# EAGLE board CounterModule (EAGLE 7.7.0), part 1 of 2
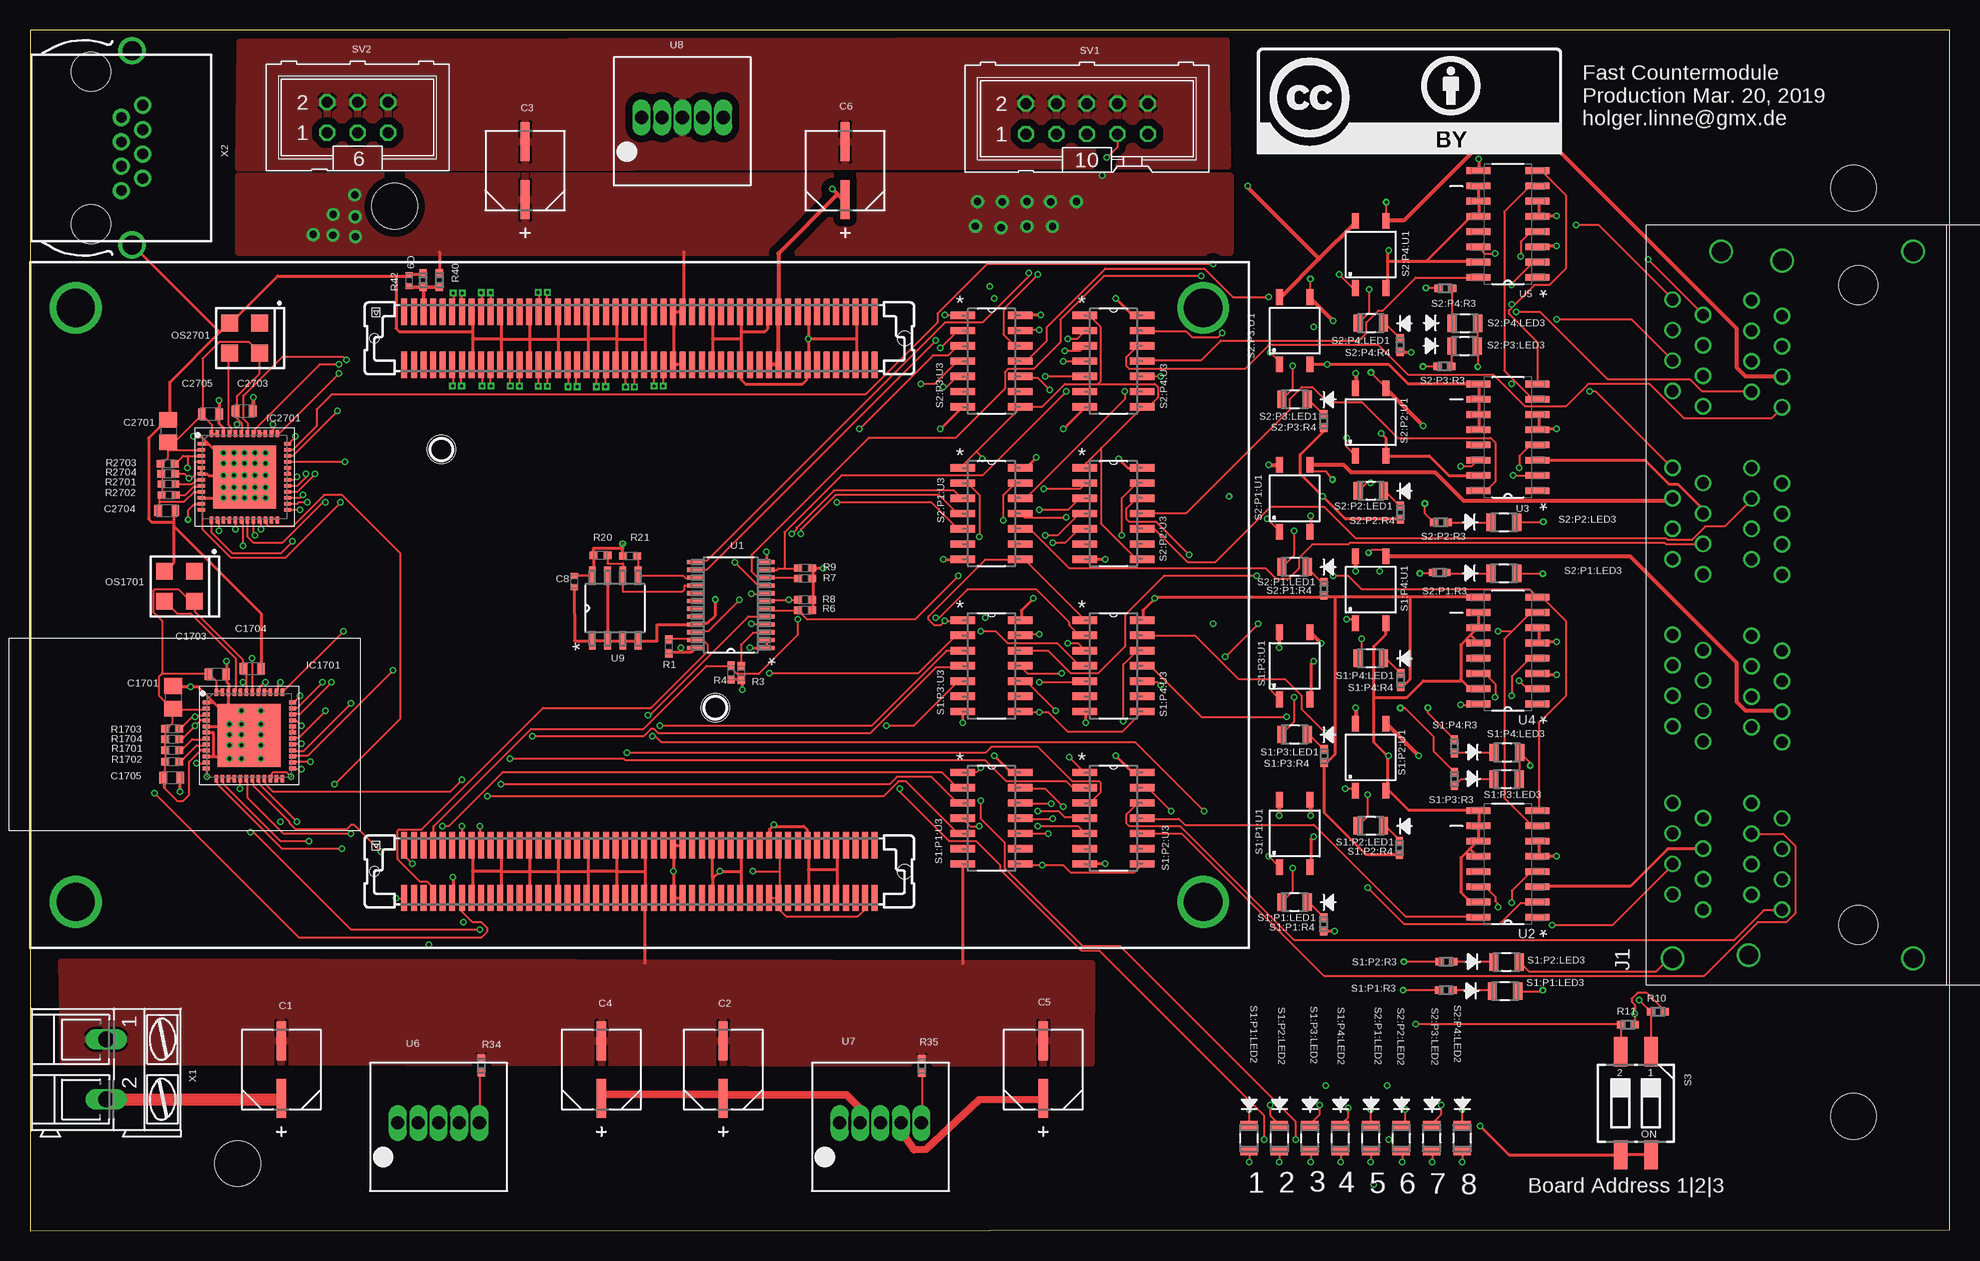
[diagram p8: board, top side]
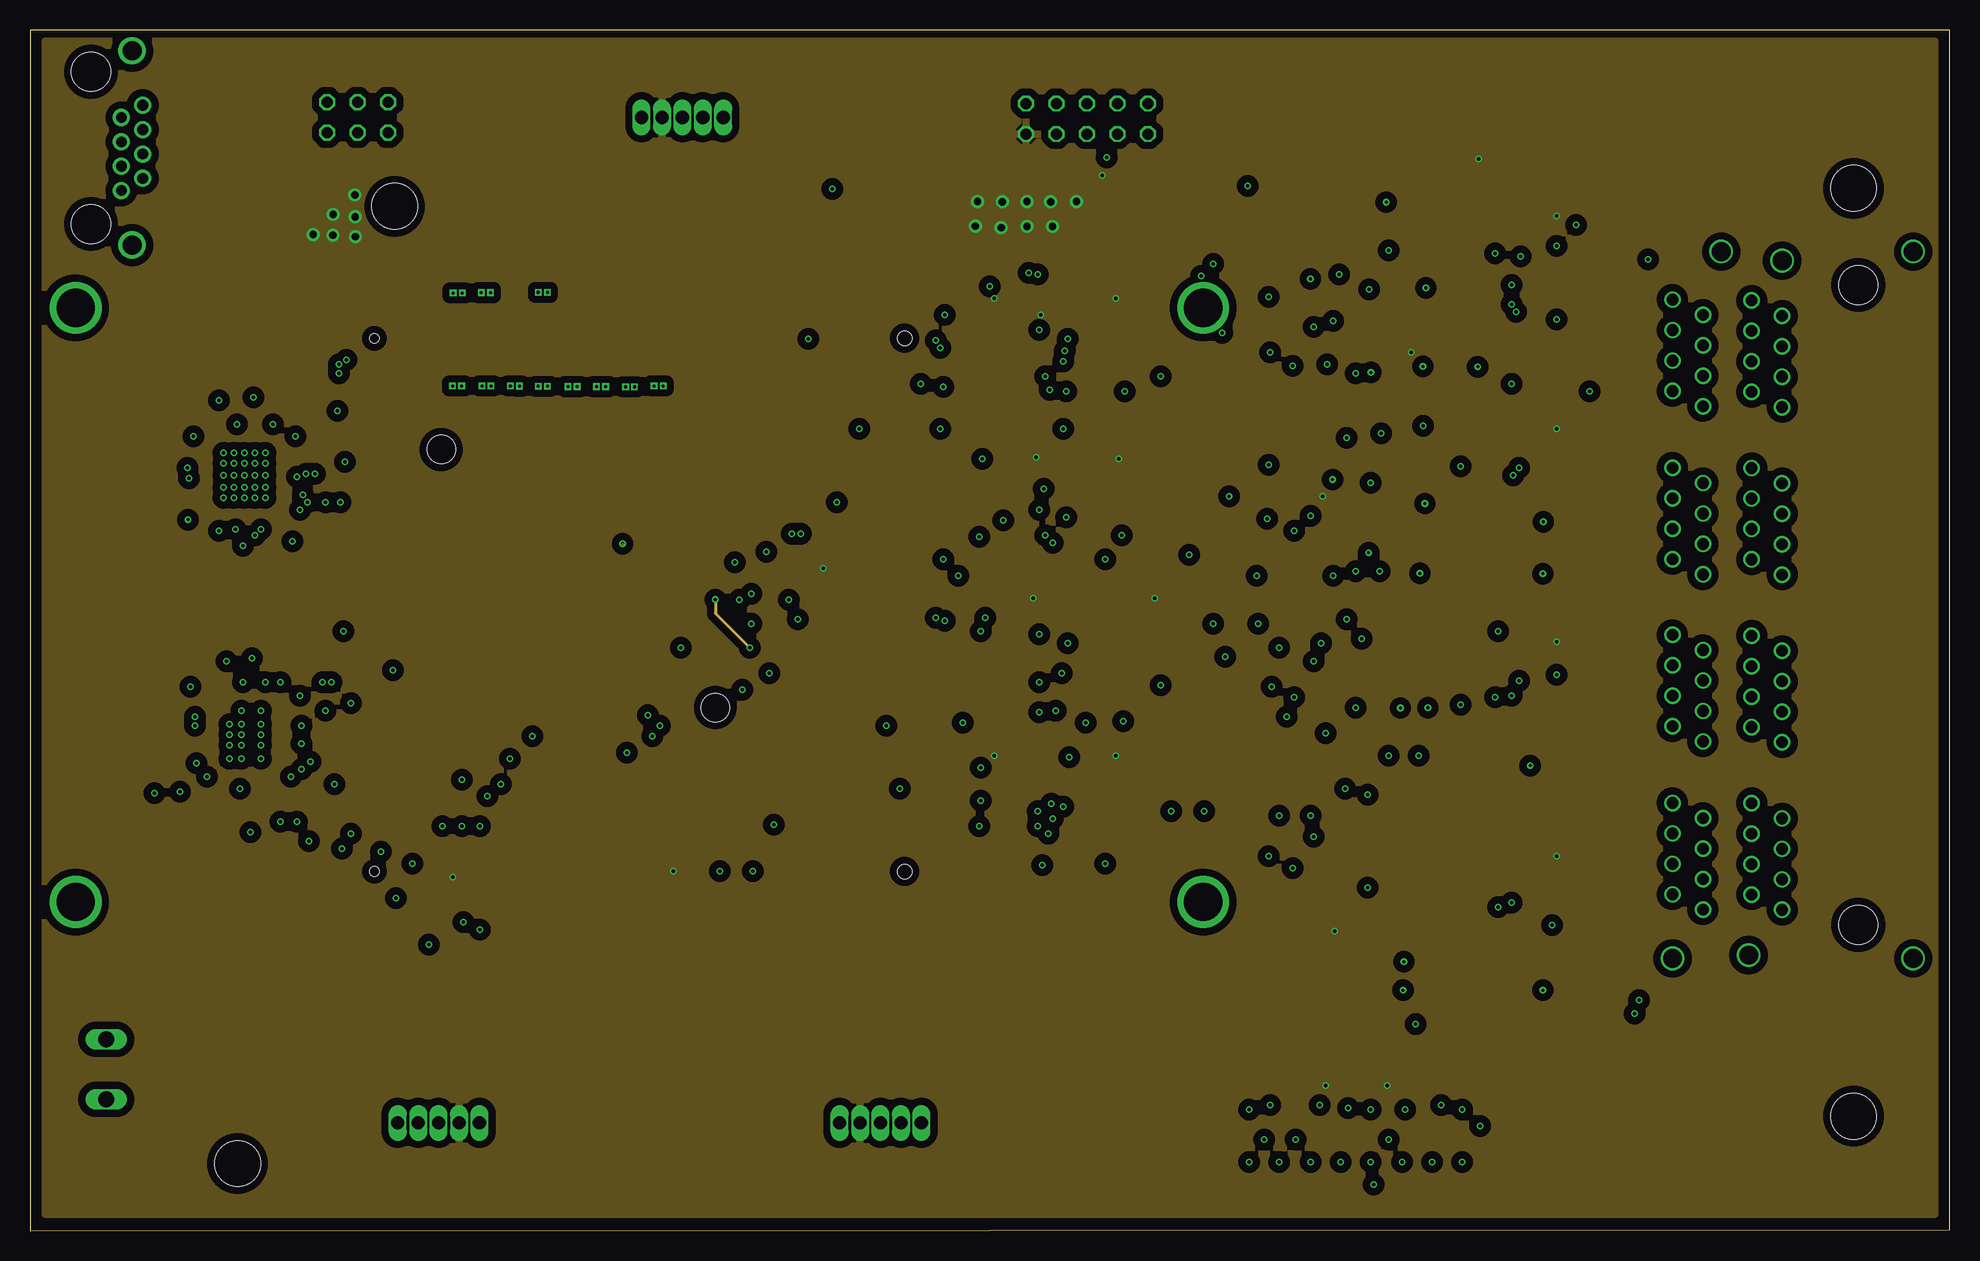
[diagram p9: board, inner layer +5V]
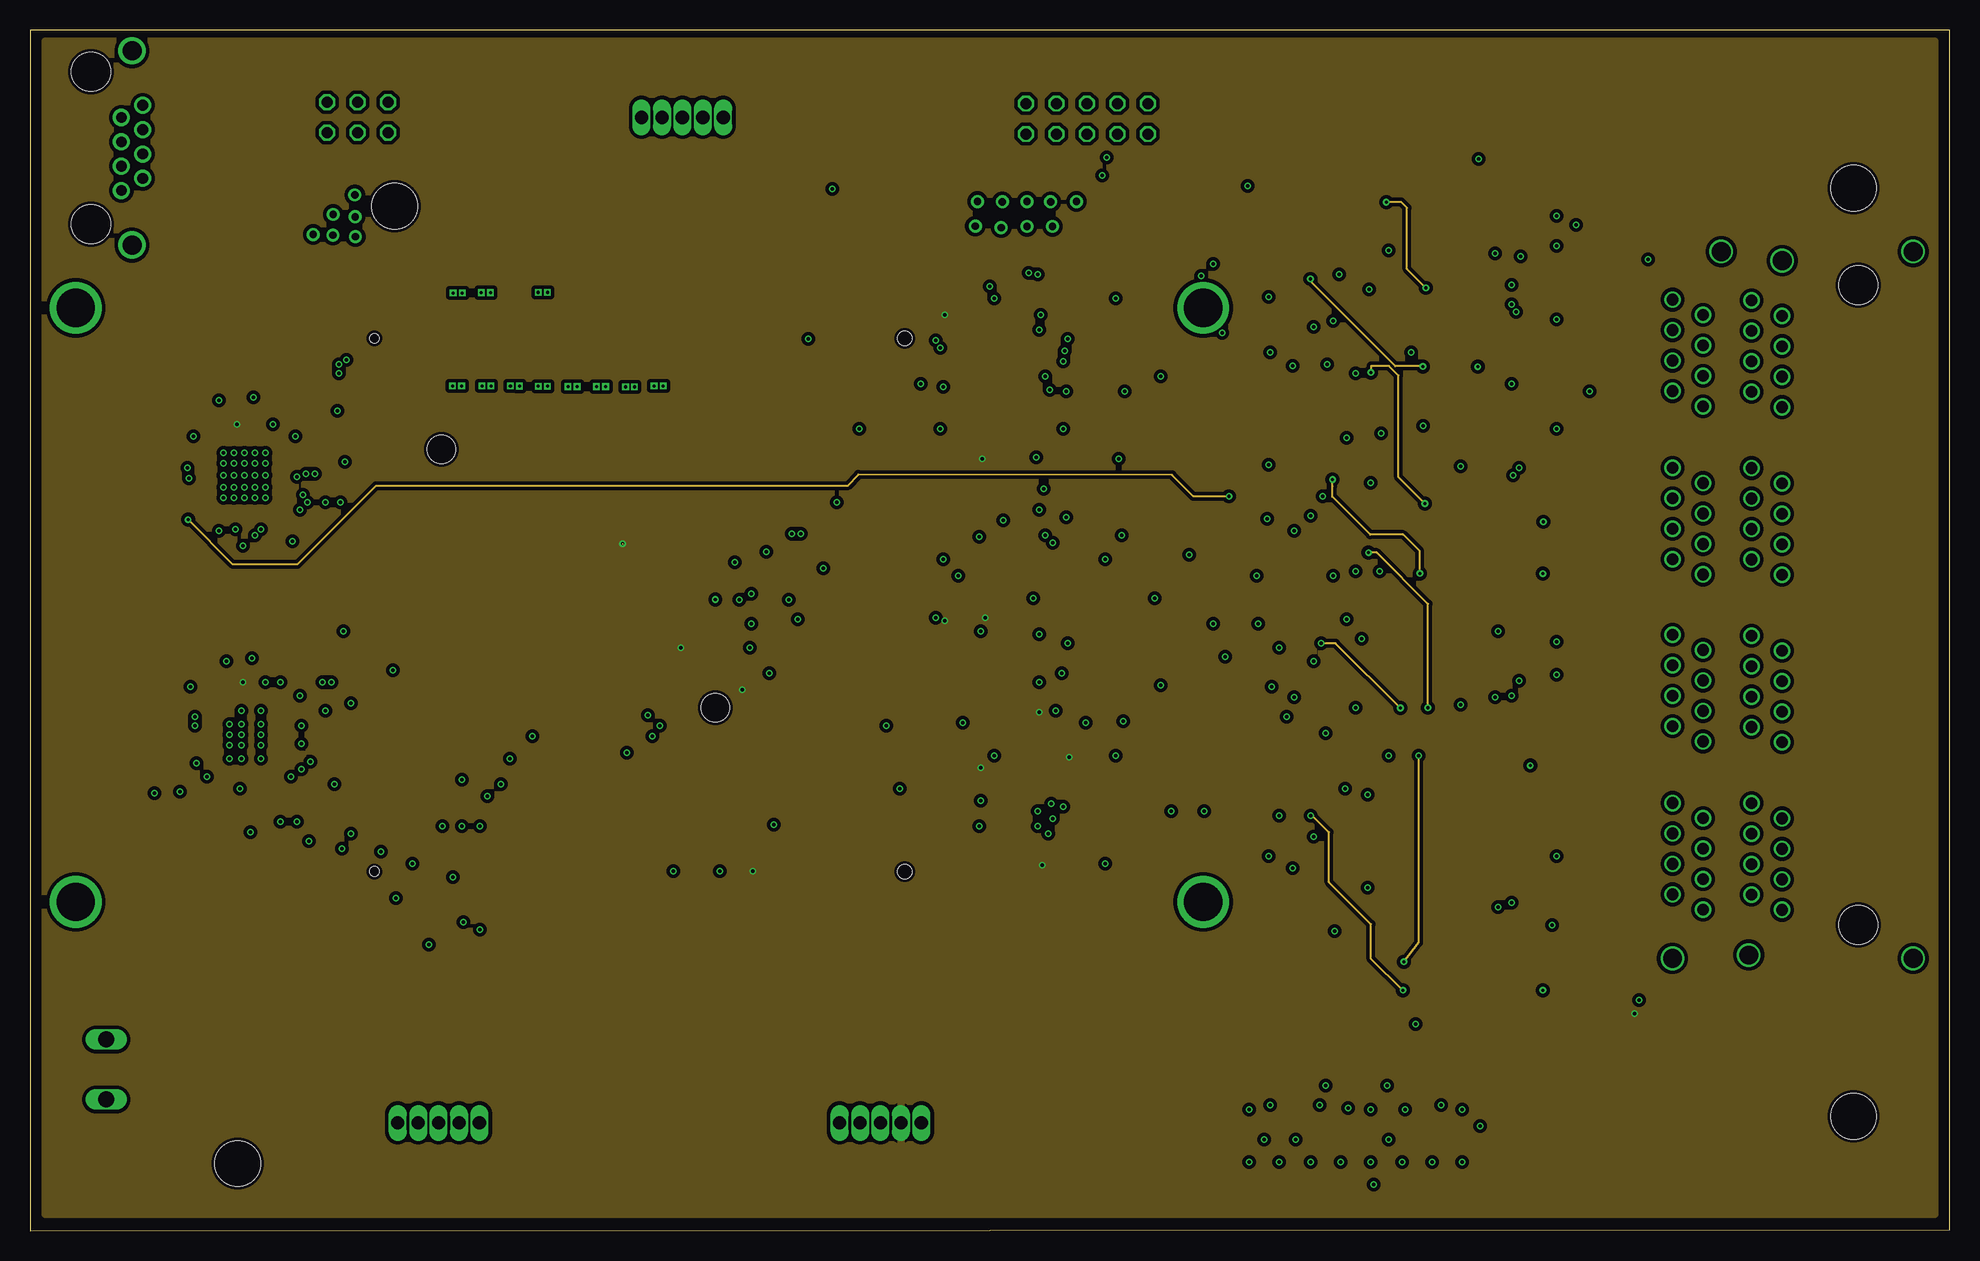
[diagram p10: board, inner layer +3V3]
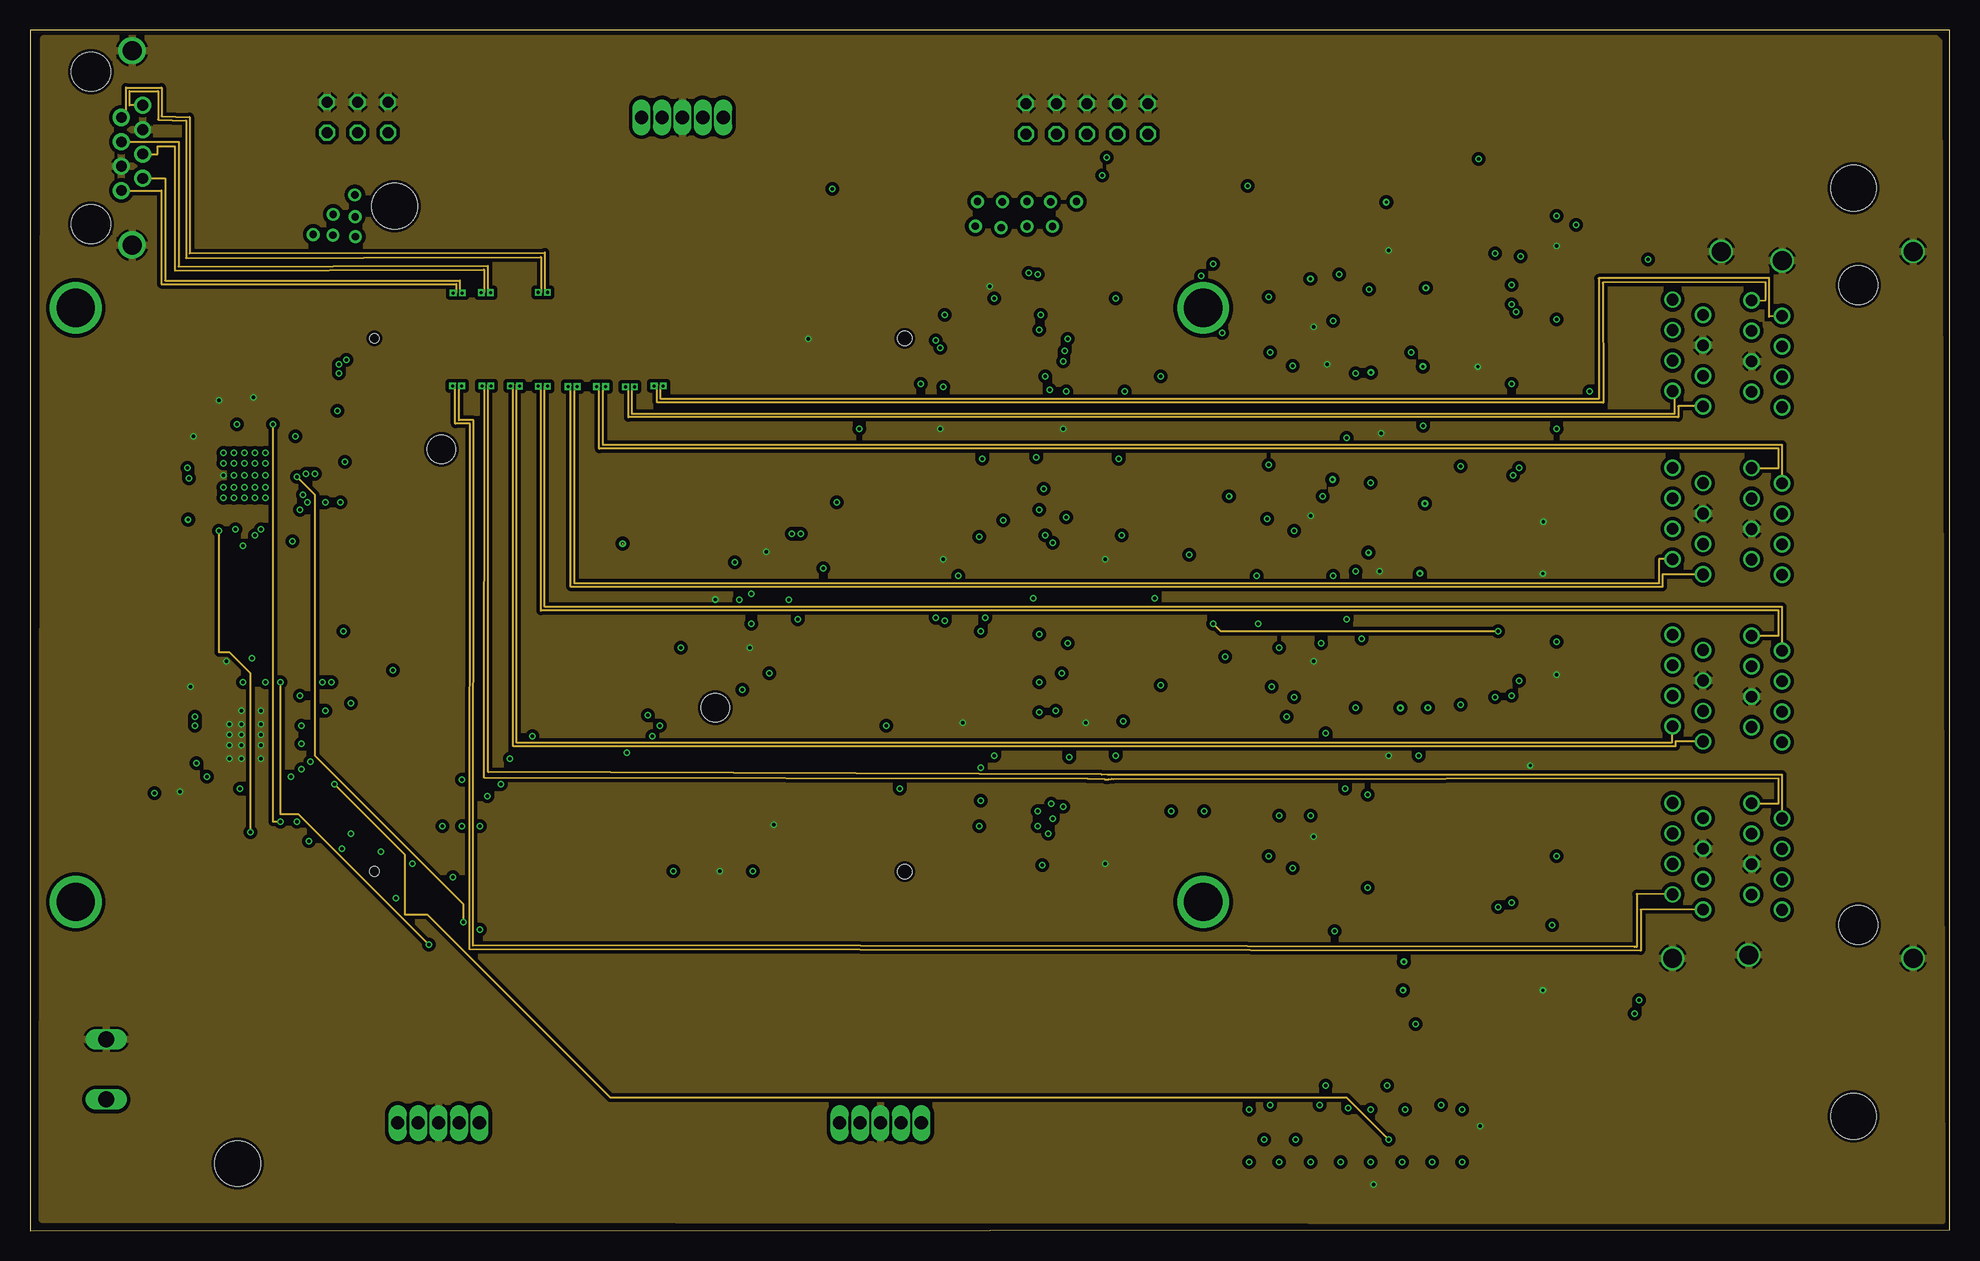
[diagram p11: board, inner layer Difflines]
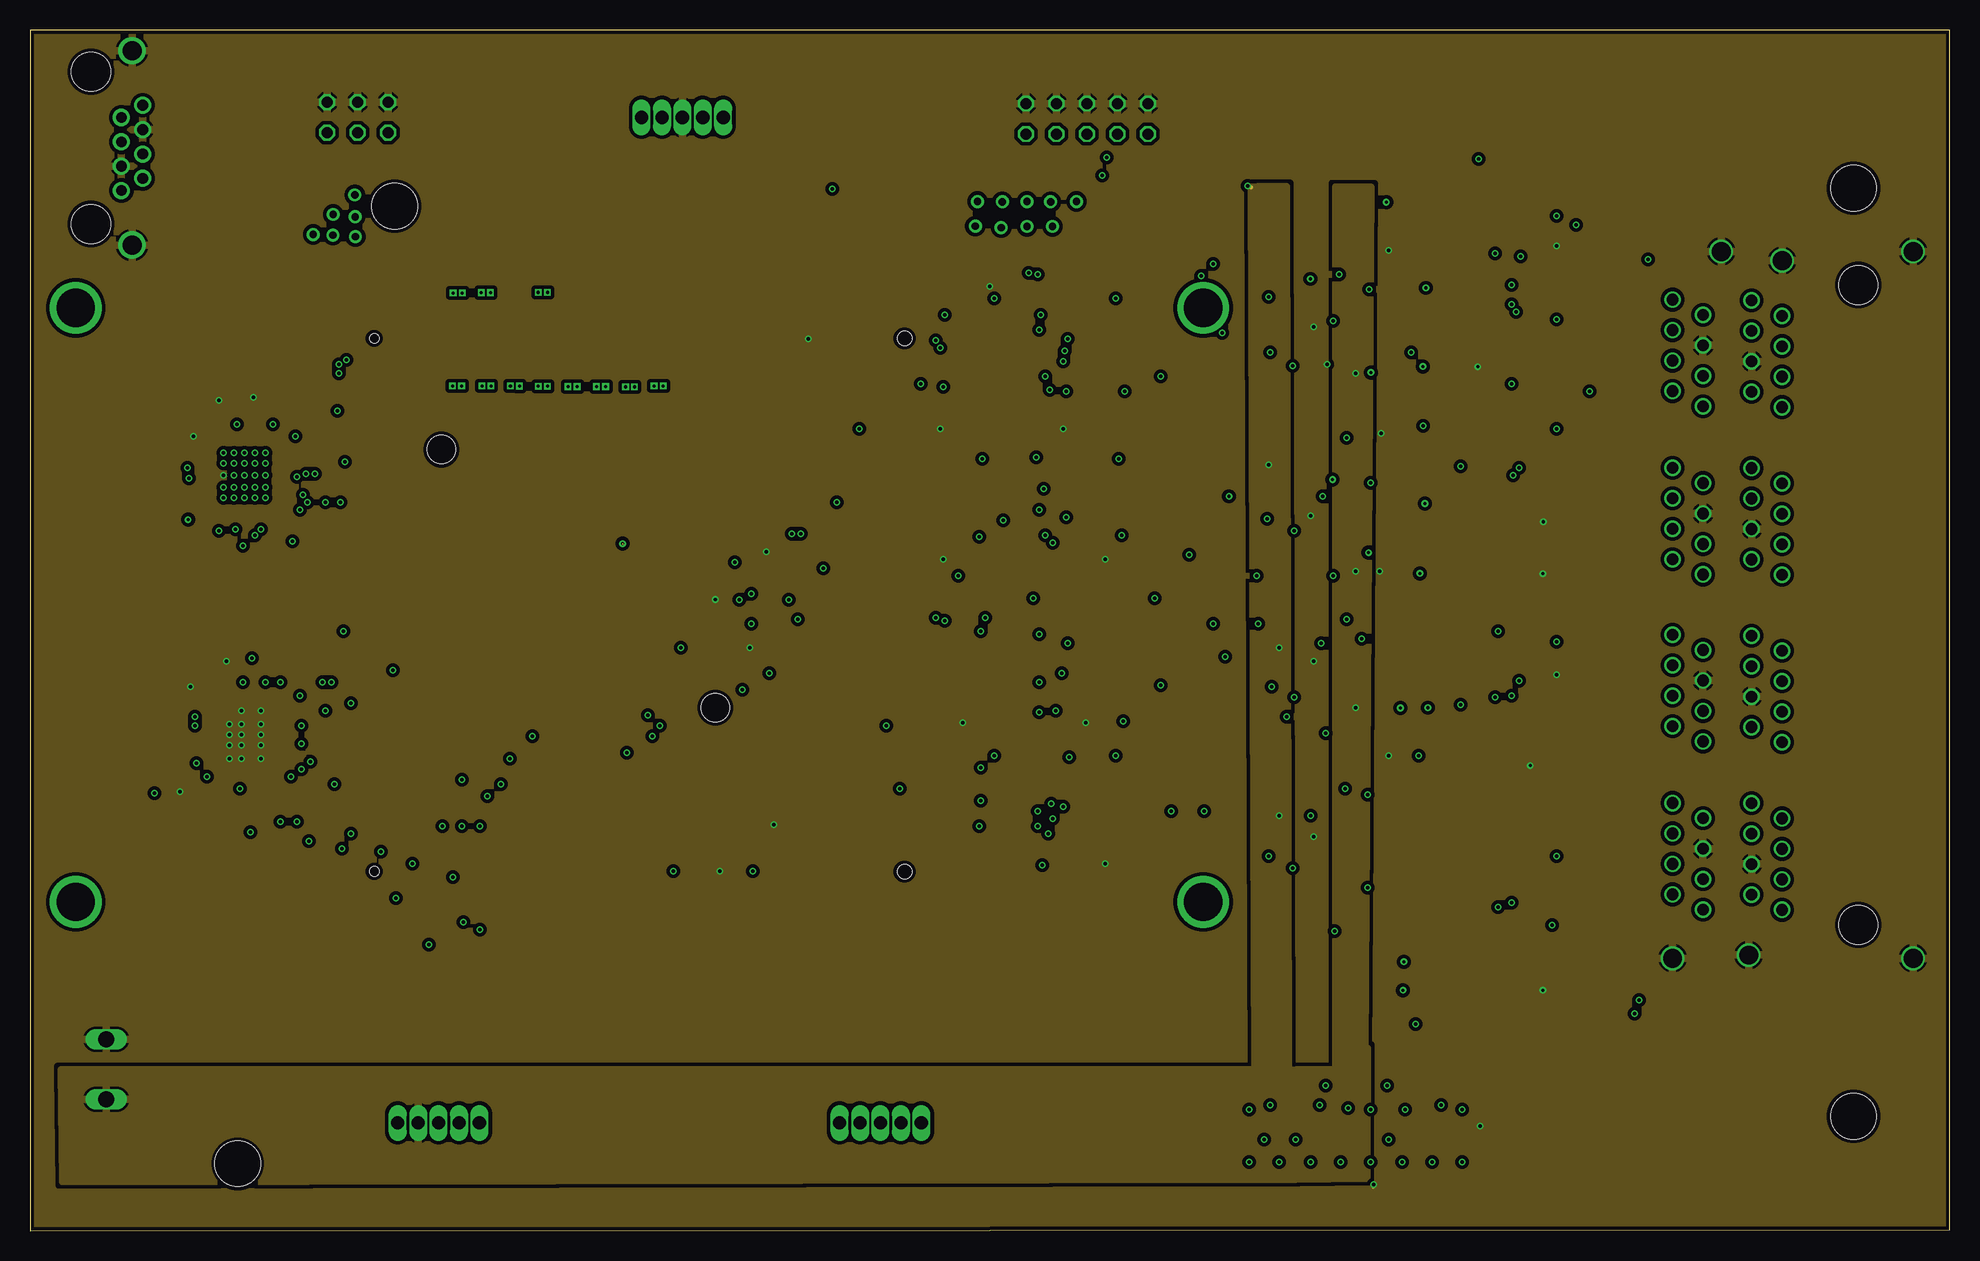
[diagram p12: board, inner layer GND+12V]
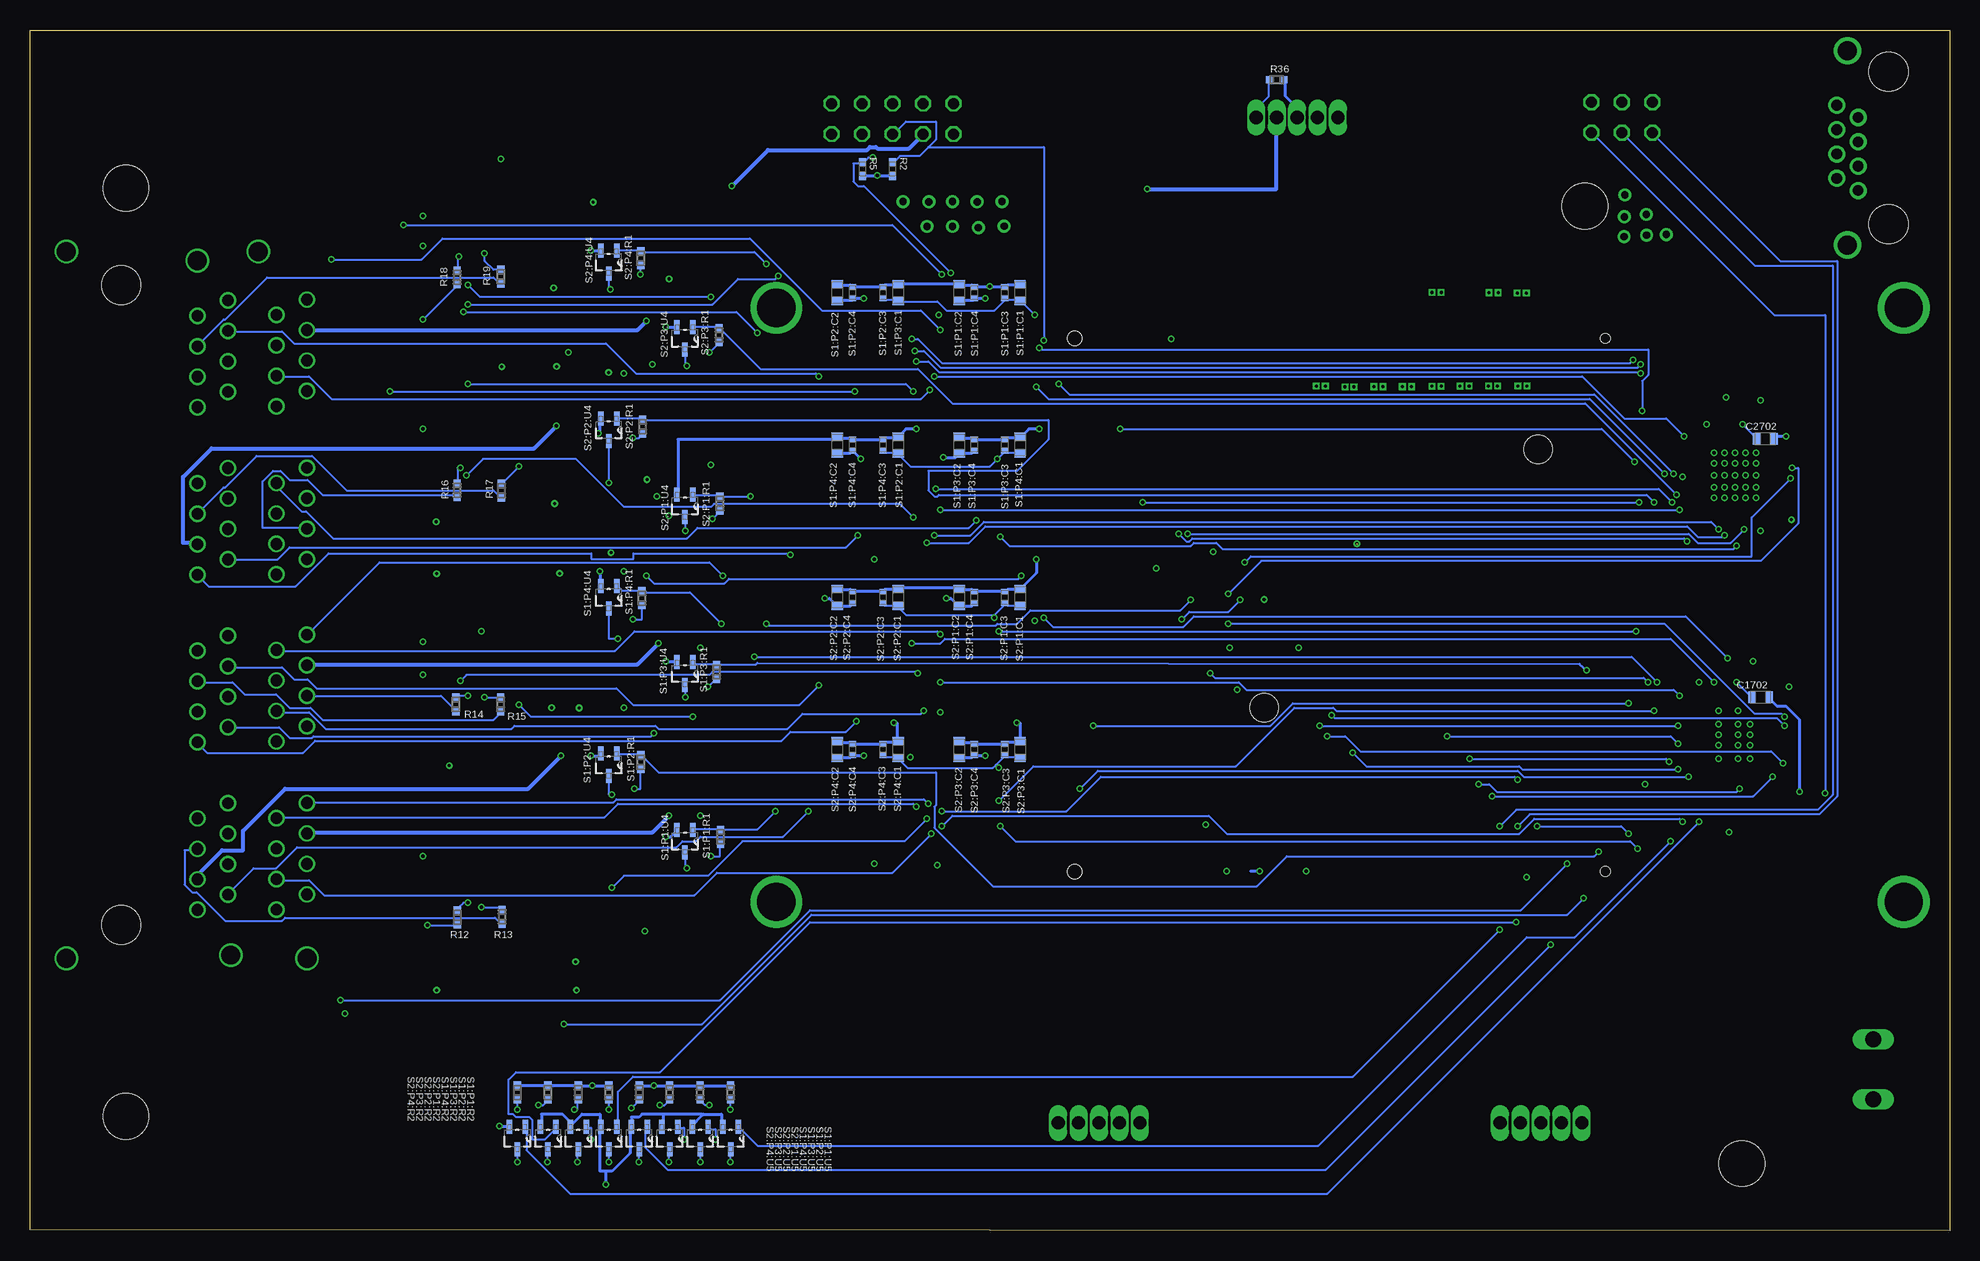
[diagram p13: board, bottom side, seen from below]

Size 160 x 100.11 mm. Coordinates in mm from the lower left corner, seen from the top.
Outline: 0,100.11 0,0 160,0.11 160,100.11 0,100.11
Copper layers (1+2+3*14+15+16): Top 0.035mm / dielectric 0.2mm / +5V 0.035mm / dielectric 0.36mm / +3V3 0.035mm / dielectric 0.28mm / Difflines 0.035mm / dielectric 0.36mm / GND+12V 0.035mm / dielectric 0.2mm / Bottom 0.035mm
Design rules "PCB-POOL HighSpec_ML6 *": minimum track width 0.15mm, minimum drill 0.2mm, track to track 0.15mm, track to pad 0.15mm, pad to pad 0.15mm, via to via 0.15mm, smd to smd 0.14mm, copper to edge 0.15mm, drill to drill 0.15mm, minimum pad ring 0.2mm, minimum via ring 0.15mm, stop-mask expansion 0.075mm, vias tented up to drill 0mil, thermal gap 0.2mm
Net classes: 0 default: width 0.15 mm, drill 0.254 mm, clearance 0.15 mm; 1 power: width 0.25 mm, drill 0.254 mm, clearance 0.305 mm to class 0, clearance 0.305 mm; 2 xpower: width 0.35 mm, drill 0.254 mm, clearance 0.305 mm to class 0, clearance 0.305 mm to class 1, clearance 0.305 mm
Holes 3.81 mm at 152,86.91 152,9.56 17.3,5.61 30.4,85.41

## Footprints (pad centres in the part's own frame; a part is rotated, then mirrored left to right if it is on the bottom)
CAPAE660X800N = smd 3.251 x 0.762: 1 -2.413,0; 2 2.413,0
CAPC1005X60N = smd 0.457 x 0.61: 1 -0.483,0; 2 0.483,0
C0805 = smd 1.3 x 1.5: 1 -0.95,0; 2 0.95,0
CAPC1608X90N = smd 0.66 x 0.94: 1 -0.711,0; 2 0.711,0
QFN50P700X700X80-49N = smd 0.6 x 0.3: 1 -3.6,2.75; 2 -3.6,2.25; 3 -3.6,1.75; 4 -3.6,1.25; 5 -3.6,0.75; 6 -3.6,0.25; 7 -3.6,-0.25; 8 -3.6,-0.75; 9 -3.6,-1.25; 10 -3.6,-1.75; 11 -3.6,-2.25; 12 -3.6,-2.75; 25 3.6,-2.75; 26 3.6,-2.25; 27 3.6,-1.75; 28 3.6,-1.25; 29 3.6,-0.75; 30 3.6,-0.25; 31 3.6,0.25; 32 3.6,0.75; 33 3.6,1.25; 34 3.6,1.75; 35 3.6,2.25; 36 3.6,2.75 | smd 0.3 x 0.6: 13 -2.75,-3.6; 14 -2.25,-3.6; 15 -1.75,-3.6; 16 -1.25,-3.6; 17 -0.75,-3.6; 18 -0.25,-3.6; 19 0.25,-3.6; 20 0.75,-3.6; 21 1.25,-3.6; 22 1.75,-3.6; 23 2.25,-3.6; 24 2.75,-3.6; 37 2.75,3.6; 38 2.25,3.6; 39 1.75,3.6; 40 1.25,3.6; 41 0.75,3.6; 42 0.25,3.6; 43 -0.25,3.6; 44 -0.75,3.6; 45 -1.25,3.6; 46 -1.75,3.6; 47 -2.25,3.6; 48 -2.75,3.6 | smd 5.25 x 5.25: 49 0,0
AMP2X4 = drill 1.57: GND@1 -2.79,-4.57; GND@2 56.13,-4.57; GND@3 -2.52,9.14; GND@4 55.37,6.35; GND@5 -2.79,15.49; GND@6 56.13,11.43 | drill 0.97: P1-1 10.16,15.49; P1-2 8.89,12.95; P1-3 7.62,15.49; P1-4 6.35,12.95; P1-5 5.08,15.49; P1-6 3.81,12.95; P1-7 2.54,15.49; P1-8 1.27,12.95; P2-1 1.25,6.35; P2-2 2.52,8.89; P2-3 3.79,6.35; P2-4 5.06,8.89; P2-5 6.33,6.35; P2-6 7.6,8.89; P2-7 8.87,6.35; P2-8 10.14,8.89; P3-1 24.18,15.49; P3-2 22.91,12.95; P3-3 21.64,15.49; P3-4 20.37,12.95; P3-5 19.1,15.49; P3-6 17.83,12.95; P3-7 16.56,15.49; P3-8 15.29,12.95; P4-1 15.22,6.35; P4-2 16.49,8.89; P4-3 17.76,6.35; P4-4 19.03,8.89; P4-5 20.3,6.35; P4-6 21.57,8.89; P4-7 22.84,6.35; P4-8 24.11,8.89; P5-1 38.1,15.49; P5-2 36.83,12.95; P5-3 35.56,15.49; P5-4 34.29,12.95; P5-5 33.02,15.49; P5-6 31.75,12.95; P5-7 30.48,15.49; P5-8 29.21,12.95; P6-1 29.19,6.35; P6-2 30.46,8.89; P6-3 31.73,6.35; P6-4 33,8.89; P6-5 34.27,6.35; P6-6 35.54,8.89; P6-7 36.81,6.35; P6-8 38.08,8.89; P7-1 52.12,15.49; P7-2 50.85,12.95; P7-3 49.58,15.49; P7-4 48.31,12.95; P7-5 47.04,15.49; P7-6 45.77,12.95; P7-7 44.5,15.49; P7-8 43.23,12.95; P8-1 43.16,6.35; P8-2 44.43,8.89; P8-3 45.7,6.35; P8-4 46.97,8.89; P8-5 48.24,6.35; P8-6 49.51,8.89; P8-7 50.78,6.35; P8-8 52.05,8.89 | hole 3.251: 0,0; 53.34,0
MICROZED_REV_F = smd 0.5 x 2.2: JX1_1 19.6,-24.425; JX1_2 19.6,-20.025; JX1_3 18.8,-24.425; JX1_4 18.8,-20.025; JX1_5 18,-24.425; JX1_6 18,-20.025; JX1_7 17.2,-24.425; JX1_8 17.2,-20.025; JX1_9 16.4,-24.425; JX1_10 16.4,-20.025; JX1_11 15.6,-24.425; JX1_12 15.6,-20.025; JX1_13 14.8,-24.425; JX1_14 14.8,-20.025; JX1_15 14,-24.425; JX1_16 14,-20.025; JX1_17 13.2,-24.425; JX1_18 13.2,-20.025; JX1_19 12.4,-24.425; JX1_20 12.4,-20.025; JX1_21 11.6,-24.425; JX1_22 11.6,-20.025; JX1_23 10.8,-24.425; JX1_24 10.8,-20.025; JX1_25 10,-24.425; JX1_26 10,-20.025; JX1_27 9.2,-24.425; JX1_28 9.2,-20.025; JX1_29 8.4,-24.425; JX1_30 8.4,-20.025; JX1_31 7.6,-24.425; JX1_32 7.6,-20.025; JX1_33 6.8,-24.425; JX1_34 6.8,-20.025; JX1_35 6,-24.425; JX1_36 6,-20.025; JX1_37 5.2,-24.425; JX1_38 5.2,-20.025; JX1_39 4.4,-24.425; JX1_40 4.4,-20.025; JX1_41 3.6,-24.425; JX1_42 3.6,-20.025; JX1_43 2.8,-24.425; JX1_44 2.8,-20.025; JX1_45 2,-24.425; JX1_46 2,-20.025; JX1_47 1.2,-24.425; JX1_48 1.2,-20.025; JX1_49 0.4,-24.425; JX1_50 0.4,-20.025; JX1_51 -0.4,-24.425; JX1_52 -0.4,-20.025; JX1_53 -1.2,-24.425; JX1_54 -1.2,-20.025; JX1_55 -2,-24.425; JX1_56 -2,-20.025; JX1_57 -2.8,-24.425; JX1_58 -2.8,-20.025; JX1_59 -3.6,-24.425; JX1_60 -3.6,-20.025; JX1_61 -4.4,-24.425; JX1_62 -4.4,-20.025; JX1_63 -5.2,-24.425; JX1_64 -5.2,-20.025; JX1_65 -6,-24.425; JX1_66 -6,-20.025; JX1_67 -6.8,-24.425; JX1_68 -6.8,-20.025; JX1_69 -7.6,-24.425; JX1_70 -7.6,-20.025; JX1_71 -8.4,-24.425; JX1_72 -8.4,-20.025; JX1_73 -9.2,-24.425; JX1_74 -9.2,-20.025; JX1_75 -10,-24.425; JX1_76 -10,-20.025; JX1_77 -10.8,-24.425; JX1_78 -10.8,-20.025; JX1_79 -11.6,-24.425; JX1_80 -11.6,-20.025; JX1_81 -12.4,-24.425; JX1_82 -12.4,-20.025; JX1_83 -13.2,-24.425; JX1_84 -13.2,-20.025; JX1_85 -14,-24.425; JX1_86 -14,-20.025; JX1_87 -14.8,-24.425; JX1_88 -14.8,-20.025; JX1_89 -15.6,-24.425; JX1_90 -15.6,-20.025; JX1_91 -16.4,-24.425; JX1_92 -16.4,-20.025; JX1_93 -17.2,-24.425; JX1_94 -17.2,-20.025; JX1_95 -18,-24.425; JX1_96 -18,-20.025; JX1_97 -18.8,-24.425; JX1_98 -18.8,-20.025; JX1_99 -19.6,-24.425; JX1_100 -19.6,-20.025; JX2_1 19.6,20.025; JX2_2 19.6,24.425; JX2_3 18.8,20.025; JX2_4 18.8,24.425; JX2_5 18,20.025; JX2_6 18,24.425; JX2_7 17.2,20.025; JX2_8 17.2,24.425; JX2_9 16.4,20.025; JX2_10 16.4,24.425; JX2_11 15.6,20.025; JX2_12 15.6,24.425; JX2_13 14.8,20.025; JX2_14 14.8,24.425; JX2_15 14,20.025; JX2_16 14,24.425; JX2_17 13.2,20.025; JX2_18 13.2,24.425; JX2_19 12.4,20.025; JX2_20 12.4,24.425; JX2_21 11.6,20.025; JX2_22 11.6,24.425; JX2_23 10.8,20.025; JX2_24 10.8,24.425; JX2_25 10,20.025; JX2_26 10,24.425; JX2_27 9.2,20.025; JX2_28 9.2,24.425; JX2_29 8.4,20.025; JX2_30 8.4,24.425; JX2_31 7.6,20.025; JX2_32 7.6,24.425; JX2_33 6.8,20.025; JX2_34 6.8,24.425; JX2_35 6,20.025; JX2_36 6,24.425; JX2_37 5.2,20.025; JX2_38 5.2,24.425; JX2_39 4.4,20.025; JX2_40 4.4,24.425; JX2_41 3.6,20.025; JX2_42 3.6,24.425; JX2_43 2.8,20.025; JX2_44 2.8,24.425; JX2_45 2,20.025; JX2_46 2,24.425; JX2_47 1.2,20.025; JX2_48 1.2,24.425; JX2_49 0.4,20.025; JX2_50 0.4,24.425; JX2_51 -0.4,20.025; JX2_52 -0.4,24.425; JX2_53 -1.2,20.025; JX2_54 -1.2,24.425; JX2_55 -2,20.025; JX2_56 -2,24.425; JX2_57 -2.8,20.025; JX2_58 -2.8,24.425; JX2_59 -3.6,20.025; JX2_60 -3.6,24.425; JX2_61 -4.4,20.025; JX2_62 -4.4,24.425; JX2_63 -5.2,20.025; JX2_64 -5.2,24.425; JX2_65 -6,20.025; JX2_66 -6,24.425; JX2_67 -6.8,20.025; JX2_68 -6.8,24.425; JX2_69 -7.6,20.025; JX2_70 -7.6,24.425; JX2_71 -8.4,20.025; JX2_72 -8.4,24.425; JX2_73 -9.2,20.025; JX2_74 -9.2,24.425; JX2_75 -10,20.025; JX2_76 -10,24.425; JX2_77 -10.8,20.025; JX2_78 -10.8,24.425; JX2_79 -11.6,20.025; JX2_80 -11.6,24.425; JX2_81 -12.4,20.025; JX2_82 -12.4,24.425; JX2_83 -13.2,20.025; JX2_84 -13.2,24.425; JX2_85 -14,20.025; JX2_86 -14,24.425; JX2_87 -14.8,20.025; JX2_88 -14.8,24.425; JX2_89 -15.6,20.025; JX2_90 -15.6,24.425; JX2_91 -16.4,20.025; JX2_92 -16.4,24.425; JX2_93 -17.2,20.025; JX2_94 -17.2,24.425; JX2_95 -18,20.025; JX2_96 -18,24.425; JX2_97 -18.8,20.025; JX2_98 -18.8,24.425; JX2_99 -19.6,20.025; JX2_100 -19.6,24.425 | drill 3.175 pad 4.318: P$1 -46.99,24.765; P$2 -46.99,-24.765; P$3 46.99,24.765; P$4 46.99,-24.765 | hole 2.362: -6.325,8.56; 16.51,-12.954 | hole 0.8: 22.1,22.225; 22.1,-22.225 | hole 1.2: -22.1,22.225; -22.1,-22.225
5.0X3.2-4-PAD = smd 1.4 x 1.4: 1 -1.25,-1.25; 2 1.25,-1.25; 3 1.25,1.25; 4 -1.25,1.25
RESC1005X40N = smd 0.66 x 0.61: 1 -0.584,0; 2 0.584,0
LED_CMD17-21VGC_TR8 = smd 0.762 x 1.448: 1 -1.067,0; 2 1.067,0
LED_CMD17-21VRC_TR8 = smd 0.762 x 1.448: 1 -1.067,0; 2 1.067,0
LED_CMD17-21VYC_TR8 = smd 0.762 x 1.448: 1 -1.067,0; 2 1.067,0
4-SOP = smd 0.6 x 1.3: 1 0,-2.8; 2 2.54,-2.8; 3 2.54,2.8; 4 0,2.8
SOIC127P600X175-14N = smd 2.057 x 0.61: 1 -4.801,7.62; 2 -4.801,6.35; 3 -4.801,5.08; 4 -4.801,3.81; 5 -4.801,2.54; 6 -4.801,1.27; 7 -4.801,0; 8 0,0; 9 0,1.27; 10 0,2.54; 11 0,3.81; 12 0,5.08; 13 0,6.35; 14 0,7.62
SOT65P210X110-3N = smd 1.168 x 0.457: 1 -0.94,0.66; 2 -0.94,-0.66; 3 0.94,0
CTS-219-02 = smd 1.13 x 2.44: 1 -1.27,-4.3; 2 1.27,-4.3; 3 1.27,4.3; 4 -1.27,4.3
ML10 = drill 0.914 octagon: 1 -5.08,-1.27; 2 -5.08,1.27; 3 -2.54,-1.27; 4 -2.54,1.27; 5 0,-1.27; 6 0,1.27; 7 2.54,-1.27; 8 2.54,1.27; 9 5.08,-1.27; 10 5.08,1.27
ML6 = drill 0.914 octagon: 1 -2.54,-1.27; 2 -2.54,1.27; 3 0,-1.27; 4 0,1.27; 5 2.54,-1.27; 6 2.54,1.27
SOP65P640X110-24N = smd 1.473 x 0.356: 1 -2.921,3.581; 2 -2.921,2.921; 3 -2.921,2.286; 4 -2.921,1.626; 5 -2.921,0.965; 6 -2.921,0.33; 7 -2.921,-0.33; 8 -2.921,-0.965; 9 -2.921,-1.626; 10 -2.921,-2.286; 11 -2.921,-2.921; 12 -2.921,-3.581; 13 2.921,-3.581; 14 2.921,-2.921; 15 2.921,-2.286; 16 2.921,-1.626; 17 2.921,-0.965; 18 2.921,-0.33; 19 2.921,0.33; 20 2.921,0.965; 21 2.921,1.626; 22 2.921,2.286; 23 2.921,2.921; 24 2.921,3.581
SOIC127P600X175-16N = smd 1.981 x 0.559: 1 -2.464,4.445; 2 -2.464,3.175; 3 -2.464,1.905; 4 -2.464,0.635; 5 -2.464,-0.635; 6 -2.464,-1.905; 7 -2.464,-3.175; 8 -2.464,-4.445; 9 2.464,-4.445; 10 2.464,-3.175; 11 2.464,-1.905; 12 2.464,-0.635; 13 2.464,0.635; 14 2.464,1.905; 15 2.464,3.175; 16 2.464,4.445
TI_PTR08060WVD = drill 1.1 pad 1.27 long: 1 -6.807,0.635; 2 -5.105,0.635; 3 -3.404,0.635; 4 -1.702,0.635; 5 0,0.635
SOIC127P600X175-8N = smd 1.473 x 0.559: 1 -2.718,1.905; 2 -2.718,0.635; 3 -2.718,-0.635; 4 -2.718,-1.905; 5 2.718,-1.905; 6 2.718,-0.635; 7 2.718,0.635; 8 2.718,1.905
AK300/2 = drill 1.321 long: 1 -2.515,0; 2 2.489,0
0446200002 = drill 0.889 pad 1.422: 1 3.556,2.54; 2 2.54,4.318; 3 1.524,2.54; 4 0.508,4.318; 5 -0.508,2.54; 6 -1.524,4.318; 7 -2.54,2.54; 8 -3.556,4.318 | drill 1.575 pad 2.286: S@1 -8.103,3.429; S@2 8.103,3.429 | hole 3.251: 6.35,0; -6.35,0

## Placement (x,y rotation side)
C1  100UF  [CAPAE660X800N]  20.95,13.45 90 top
C2  100UF  [CAPAE660X800N]  57.78,13.45 90 top
C3  100UF  [CAPAE660X800N]  41.27,88.38 90 top
C4  100UF  [CAPAE660X800N]  47.62,13.45 90 top
C5  100UF  [CAPAE660X800N]  84.45,13.45 90 top
C6  100UF  [CAPAE660X800N]  67.94,88.38 90 top
C8  100 nF  [CAPC1005X60N]  45.37,54.14 270 top
C9  100 nF  [CAPC1005X60N]  31.6,79.21 270 top
C1701  10µF  [C0805]  11.94,44.48 270 top
C1702  1uF  [CAPC1608X90N]  15.75,44.48 0 bottom
C1703  1uF  [CAPC1608X90N]  15.62,46.41 0 top
C1704  1uF  [CAPC1608X90N]  18.54,46.86 0 top
C1705  1uF  [CAPC1608X90N]  11.81,37.77 0 top
C2701  10µF  [C0805]  11.54,66.67 270 top
C2702  1uF  [CAPC1608X90N]  15.35,66.04 0 bottom
C2703  1uF  [CAPC1608X90N]  17.86,68.35 0 top
C2704  1uF  [CAPC1608X90N]  11.41,60.04 0 top
C2705  1uF  [CAPC1608X90N]  15.05,68.1 0 top
IC1701  MAX14830ETM+  [QFN50P700X700X80-49N]  18.29,41.3 0 top
IC2701  MAX14830ETM+  [QFN50P700X700X80-49N]  17.89,62.86 0 top
J1  J1  [AMP2X4]  152.4,25.51 90 top
MICROZED1  MICROZED_REV_F  [MICROZED_REV_F]  50.8,52.18 180 top
OS1701  OSC-OE-CFPS-69  [5.0X3.2-4-PAD]  12.45,53.74 180 top
OS2701  OSC-OE-CFPS-69  [5.0X3.2-4-PAD]  17.9,74.44 180 top
R1  4.7 kOhm  [RESC1005X40N]  53.24,48.71 270 top
R2  4.7 kOhm  [RESC1005X40N]  88.1,88.51 270 bottom
R3  4.7 kOhm  [RESC1005X40N]  59.3,46.49 270 top
R4  4.7 kOhm  [RESC1005X40N]  58.44,46.53 270 top
R5  4.7 kOhm  [RESC1005X40N]  90.6,88.51 270 bottom
R6  4.7 kOhm  [RESC1005X40N]  64.62,51.75 180 top
R7  4.7 kOhm  [RESC1005X40N]  64.62,54.39 180 top
R8  4.7 kOhm  [RESC1005X40N]  64.62,52.62 180 top
R9  4.7 kOhm  [RESC1005X40N]  64.62,55.26 180 top
R10  10.2K  [RESC1005X40N]  135.7,18.29 180 top
R11  10.2K  [RESC1005X40N]  133.18,17.19 180 top
R12  10.2K  [RESC1005X40N]  124.38,26.14 90 bottom
R13  10.2K  [RESC1005X40N]  120.65,26.19 90 bottom
R14  10.2K  [RESC1005X40N]  124.5,43.89 90 bottom
R15  10.2K  [RESC1005X40N]  120.78,43.89 90 bottom
R16  10.2K  [RESC1005X40N]  124.4,61.74 90 bottom
R17  10.2K  [RESC1005X40N]  120.7,61.71 90 bottom
R18  10.2K  [RESC1005X40N]  124.4,79.49 90 bottom
R19  10.2K  [RESC1005X40N]  120.75,79.54 90 bottom
R20  4.7 kOhm  [RESC1005X40N]  47.55,56.31 0 top
R21  4.7 kOhm  [RESC1005X40N]  50.02,56.26 180 top
R34  267 OHM  [RESC1005X40N]  37.62,13.79 270 top
R35  432 OHM  [RESC1005X40N]  74.33,13.75 270 top
R36  619 OHM  [RESC1005X40N]  56.08,95.97 180 bottom
R40  1.02K  [RESC1005X40N]  34.13,79.25 90 top
R42  3.92K  [RESC1005X40N]  32.77,79.25 270 top
R1701  4.7 kOhm  [RESC1005X40N]  11.86,40.06 180 top
R1702  4.7 kOhm  [RESC1005X40N]  11.86,39.12 180 top
R1703  4.7 kOhm  [RESC1005X40N]  11.86,41.86 0 top
R1704  4.7 kOhm  [RESC1005X40N]  11.86,41 0 top
R2701  4.7 kOhm  [RESC1005X40N]  11.54,62.25 180 top
R2702  4.7 kOhm  [RESC1005X40N]  11.57,61.34 180 top
R2703  4.7 kOhm  [RESC1005X40N]  11.49,63.96 0 top
R2704  4.7 kOhm  [RESC1005X40N]  11.51,63.12 0 top
S1:P1:C1  1uF  [CAPC1608X90N]  77.47,78.22 90 bottom
S1:P1:C2  1uF  [CAPC1608X90N]  82.55,78.22 90 bottom
S1:P1:C3  100 nF  [CAPC1005X60N]  78.74,78.22 90 bottom
S1:P1:C4  100 nF  [CAPC1005X60N]  81.28,78.22 90 bottom
S1:P1:LED1  CMD17-21VGC_TR8  [LED_CMD17-21VGC_TR8]  105.41,27.42 180 top
S1:P1:LED2  CMD17-21VRC_TR8  [LED_CMD17-21VRC_TR8]  101.6,7.73 270 top
S1:P1:LED3  CMD17-21VYC_TR8  [LED_CMD17-21VYC_TR8]  122.95,19.99 0 top
S1:P1:R1  1K21  [RESC1005X40N]  102.44,32.85 90 bottom
S1:P1:R2  348 OHM  [RESC1005X40N]  101.6,11.54 90 bottom
S1:P1:R3  2K  [RESC1005X40N]  118.03,20.06 180 top
S1:P1:R4  124 OHM  [RESC1005X40N]  107.82,25.57 270 top
S1:P1:U1  CPC1002N  [4-SOP]  104.14,33.13 0 top
S1:P1:U3  TXS0104ED  [SOIC127P600X175-14N]  82.55,30.59 0 top
S1:P1:U4  BSS138BK  [SOT65P210X110-3N]  105.41,32.5 270 bottom
S1:P1:U5  BSS138BK  [SOT65P210X110-3N]  101.6,7.73 270 bottom
S1:P2:C1  1uF  [CAPC1608X90N]  87.63,65.52 90 bottom
S1:P2:C2  1uF  [CAPC1608X90N]  92.71,78.22 90 bottom
S1:P2:C3  100 nF  [CAPC1005X60N]  88.9,78.22 90 bottom
S1:P2:C4  100 nF  [CAPC1005X60N]  91.44,78.22 90 bottom
S1:P2:LED1  CMD17-21VGC_TR8  [LED_CMD17-21VGC_TR8]  111.76,33.77 180 top
S1:P2:LED2  CMD17-21VRC_TR8  [LED_CMD17-21VRC_TR8]  104.14,7.73 270 top
S1:P2:LED3  CMD17-21VYC_TR8  [LED_CMD17-21VYC_TR8]  123.08,22.41 0 top
S1:P2:R1  1K21  [RESC1005X40N]  109.09,39.08 90 bottom
S1:P2:R2  348 OHM  [RESC1005X40N]  104.14,11.54 90 bottom
S1:P2:R3  2K  [RESC1005X40N]  118.05,22.44 180 top
S1:P2:R4  124 OHM  [RESC1005X40N]  114.15,31.94 270 top
S1:P2:U1  CPC1002N  [4-SOP]  110.49,39.48 0 top
S1:P2:U3  TXS0104ED  [SOIC127P600X175-14N]  92.71,30.59 0 top
S1:P2:U4  BSS138BK  [SOT65P210X110-3N]  111.76,38.85 270 bottom
S1:P2:U5  BSS138BK  [SOT65P210X110-3N]  104.14,7.73 270 bottom
S1:P3:C1  1uF  [CAPC1608X90N]  87.63,78.22 90 bottom
S1:P3:C2  1uF  [CAPC1608X90N]  82.55,65.52 90 bottom
S1:P3:C3  100 nF  [CAPC1005X60N]  78.74,65.52 90 bottom
S1:P3:C4  100 nF  [CAPC1005X60N]  81.28,65.52 90 bottom
S1:P3:LED1  CMD17-21VGC_TR8  [LED_CMD17-21VGC_TR8]  105.41,41.39 180 top
S1:P3:LED2  CMD17-21VRC_TR8  [LED_CMD17-21VRC_TR8]  106.68,7.73 270 top
S1:P3:LED3  CMD17-21VYC_TR8  [LED_CMD17-21VYC_TR8]  123.08,37.66 0 top
S1:P3:R1  1K21  [RESC1005X40N]  102.77,46.6 90 bottom
S1:P3:R2  348 OHM  [RESC1005X40N]  106.68,11.54 90 bottom
S1:P3:R3  2K  [RESC1005X40N]  118.72,37.66 90 top
S1:P3:R4  124 OHM  [RESC1005X40N]  107.87,39.59 270 top
S1:P3:U1  CPC1002N  [4-SOP]  104.14,47.1 0 top
S1:P3:U3  TXS0104ED  [SOIC127P600X175-14N]  82.55,43.29 0 top
S1:P3:U4  BSS138BK  [SOT65P210X110-3N]  105.41,46.47 270 bottom
S1:P3:U5  BSS138BK  [SOT65P210X110-3N]  106.68,7.73 270 bottom
S1:P4:C1  1uF  [CAPC1608X90N]  77.47,65.52 90 bottom
S1:P4:C2  1uF  [CAPC1608X90N]  92.71,65.52 90 bottom
S1:P4:C3  100 nF  [CAPC1005X60N]  88.9,65.52 90 bottom
S1:P4:C4  100 nF  [CAPC1005X60N]  91.44,65.52 90 bottom
S1:P4:LED1  CMD17-21VGC_TR8  [LED_CMD17-21VGC_TR8]  111.76,47.74 180 top
S1:P4:LED2  CMD17-21VRC_TR8  [LED_CMD17-21VRC_TR8]  109.22,7.73 270 top
S1:P4:LED3  CMD17-21VYC_TR8  [LED_CMD17-21VYC_TR8]  123.1,39.89 0 top
S1:P4:R1  1K21  [RESC1005X40N]  108.99,52.74 90 bottom
S1:P4:R2  348 OHM  [RESC1005X40N]  109.22,11.54 90 bottom
S1:P4:R3  2K  [RESC1005X40N]  118.72,40.39 90 top
S1:P4:R4  124 OHM  [RESC1005X40N]  114.25,45.91 270 top
S1:P4:U1  CPC1002N  [4-SOP]  110.49,53.45 0 top
S1:P4:U3  TXS0104ED  [SOIC127P600X175-14N]  92.71,43.29 0 top
S1:P4:U4  BSS138BK  [SOT65P210X110-3N]  111.76,52.82 270 bottom
S1:P4:U5  BSS138BK  [SOT65P210X110-3N]  109.22,7.73 270 bottom
S2:P1:C1  1uF  [CAPC1608X90N]  77.47,52.82 90 bottom
S2:P1:C2  1uF  [CAPC1608X90N]  82.55,52.82 90 bottom
S2:P1:C3  100 nF  [CAPC1005X60N]  78.74,52.82 90 bottom
S2:P1:C4  100 nF  [CAPC1005X60N]  81.28,52.82 90 bottom
S2:P1:LED1  CMD17-21VGC_TR8  [LED_CMD17-21VGC_TR8]  105.41,55.36 180 top
S2:P1:LED2  CMD17-21VRC_TR8  [LED_CMD17-21VRC_TR8]  111.76,7.73 270 top
S2:P1:LED3  CMD17-21VYC_TR8  [LED_CMD17-21VYC_TR8]  122.85,54.81 0 top
S2:P1:R1  1K21  [RESC1005X40N]  102.49,60.64 90 bottom
S2:P1:R2  348 OHM  [RESC1005X40N]  111.76,11.54 90 bottom
S2:P1:R3  2K  [RESC1005X40N]  117.5,54.89 180 top
S2:P1:R4  124 OHM  [RESC1005X40N]  107.85,53.53 270 top
S2:P1:U1  CPC1002N  [4-SOP]  104.14,61.07 0 top
S2:P1:U3  TXS0104ED  [SOIC127P600X175-14N]  82.55,55.99 0 top
S2:P1:U4  BSS138BK  [SOT65P210X110-3N]  105.41,60.44 270 bottom
S2:P1:U5  BSS138BK  [SOT65P210X110-3N]  111.76,7.73 270 bottom
S2:P2:C1  1uF  [CAPC1608X90N]  87.63,52.82 90 bottom
S2:P2:C2  1uF  [CAPC1608X90N]  92.71,52.82 90 bottom
S2:P2:C3  100 nF  [CAPC1005X60N]  88.9,52.82 90 bottom
S2:P2:C4  100 nF  [CAPC1005X60N]  91.44,52.82 90 bottom
S2:P2:LED1  CMD17-21VGC_TR8  [LED_CMD17-21VGC_TR8]  111.76,61.71 180 top
S2:P2:LED2  CMD17-21VRC_TR8  [LED_CMD17-21VRC_TR8]  114.3,7.73 270 top
S2:P2:LED3  CMD17-21VYC_TR8  [LED_CMD17-21VYC_TR8]  122.85,59.06 0 top
S2:P2:R1  1K21  [RESC1005X40N]  108.94,67.04 90 bottom
S2:P2:R2  348 OHM  [RESC1005X40N]  114.3,11.54 90 bottom
S2:P2:R3  2K  [RESC1005X40N]  117.6,59.06 180 top
S2:P2:R4  124 OHM  [RESC1005X40N]  114.22,59.88 270 top
S2:P2:U1  CPC1002N  [4-SOP]  110.49,67.42 0 top
S2:P2:U3  TXS0104ED  [SOIC127P600X175-14N]  92.71,55.99 0 top
S2:P2:U4  BSS138BK  [SOT65P210X110-3N]  111.76,66.79 270 bottom
S2:P2:U5  BSS138BK  [SOT65P210X110-3N]  114.3,7.73 270 bottom
S2:P3:C1  1uF  [CAPC1608X90N]  77.47,40.12 90 bottom
S2:P3:C2  1uF  [CAPC1608X90N]  82.55,40.12 90 bottom
S2:P3:C3  100 nF  [CAPC1005X60N]  78.74,40.12 90 bottom
S2:P3:C4  100 nF  [CAPC1005X60N]  81.28,40.12 90 bottom
S2:P3:LED1  CMD17-21VGC_TR8  [LED_CMD17-21VGC_TR8]  105.41,69.33 180 top
S2:P3:LED2  CMD17-21VRC_TR8  [LED_CMD17-21VRC_TR8]  116.84,7.73 270 top
S2:P3:LED3  CMD17-21VYC_TR8  [LED_CMD17-21VYC_TR8]  119.58,73.76 0 top
S2:P3:R1  1K21  [RESC1005X40N]  102.57,74.69 90 bottom
S2:P3:R2  348 OHM  [RESC1005X40N]  116.84,11.54 90 bottom
S2:P3:R3  2K  [RESC1005X40N]  117.9,72.06 180 top
S2:P3:R4  124 OHM  [RESC1005X40N]  107.82,67.5 270 top
S2:P3:U1  CPC1002N  [4-SOP]  104.14,75.04 0 top
S2:P3:U3  TXS0104ED  [SOIC127P600X175-14N]  82.55,68.69 0 top
S2:P3:U4  BSS138BK  [SOT65P210X110-3N]  105.41,74.41 270 bottom
S2:P3:U5  BSS138BK  [SOT65P210X110-3N]  116.81,7.73 270 bottom
S2:P4:C1  1uF  [CAPC1608X90N]  87.63,40.12 90 bottom
S2:P4:C2  1uF  [CAPC1608X90N]  92.71,40.12 90 bottom
S2:P4:C3  100 nF  [CAPC1005X60N]  88.9,40.12 90 bottom
S2:P4:C4  100 nF  [CAPC1005X60N]  91.44,40.12 90 bottom
S2:P4:LED1  CMD17-21VGC_TR8  [LED_CMD17-21VGC_TR8]  111.76,75.68 180 top
S2:P4:LED2  CMD17-21VRC_TR8  [LED_CMD17-21VRC_TR8]  119.38,7.73 270 top
S2:P4:LED3  CMD17-21VYC_TR8  [LED_CMD17-21VYC_TR8]  119.6,75.66 0 top
S2:P4:R1  1K21  [RESC1005X40N]  109.09,81.09 90 bottom
S2:P4:R2  348 OHM  [RESC1005X40N]  119.38,11.54 90 bottom
S2:P4:R3  2K  [RESC1005X40N]  117.97,78.56 180 top
S2:P4:R4  124 OHM  [RESC1005X40N]  114.2,73.85 270 top
S2:P4:U1  CPC1002N  [4-SOP]  110.49,81.39 0 top
S2:P4:U3  TXS0104ED  [SOIC127P600X175-14N]  92.71,68.69 0 top
S2:P4:U4  BSS138BK  [SOT65P210X110-3N]  111.76,80.76 270 bottom
S2:P4:U5  BSS138BK  [SOT65P210X110-3N]  119.38,7.73 270 bottom
S3  219-02  [CTS-219-02]  133.85,10.64 180 top
SV1  SV1  [ML10]  88.1,92.71 0 top
SV2  SV2  [ML6]  27.3,92.82 0 top
U1  PCA9547PW  [SOP65P640X110-24N]  58.42,52.18 180 top
U2  AD5242BRZ100  [SOIC127P600X175-16N]  123.19,30.59 180 top
U3  AD5242BRZ100  [SOIC127P600X175-16N]  123.19,66.15 180 top
U4  AD5242BRZ100  [SOIC127P600X175-16N]  123.19,48.37 180 top
U5  AD5242BRZ100  [SOIC127P600X175-16N]  123.19,83.93 180 top
U6  PTR08060WVD  [TI_PTR08060WVD]  37.47,8.37 0 top
U7  PTR08060WVD  [TI_PTR08060WVD]  74.3,8.37 0 top
U8  PTR08060WVD  [TI_PTR08060WVD]  57.78,92.19 0 top
U9  24AA02E48-I/SN  [SOIC127P600X175-8N]  48.77,51.91 90 top
X1  X1  [AK300/2]  6.35,13.45 270 top
X2  0446200002  [0446200002]  5.08,90.28 270 top

## Tracks (layer width: path | path; a pad name or v marks a point on that pad's centre or on a via)
!BRD_ADR0  (via drill 0.25)
  Top 0.15: S3.1 135.12,14.99 135.12,18.24 R10.2 135,18.36 v134.12,19.24 | v31.88,30.61 31.25,31.24 31.25,32.11 MICROZED1.JX2_1
  Bottom 0.15: v31.88,30.61 35.75,26.74 95,26.74 102.5,19.24 v134.12,19.24
!BRD_ADR1  (via drill 0.25)
  Top 0.15: S3.2 132.62,14.99 132.62,17.11 R11.2 132.5,17.24 v115.5,17.24 | v30.5,27.74 31.12,27.74 MICROZED1.JX2_2
  Bottom 0.15: v30.5,27.74 31.88,26.36 94.88,26.36 104,17.24 v115.5,17.24
+2V5  (via drill 0.25)
  Top 0.35: MICROZED1.JX1_78 61.62,72.24 62.38,72.24 MICROZED1.JX1_80 62.38,72.36 62.38,76.49 MICROZED1.JX1_79 62.38,76.74 62.38,81.49 67.31,86.43 | 67.31,86.43 67.88,85.86 C6.1 | 67.31,86.43 v66.88,86.86
  Bottom 0.35: v66.88,86.86 56.12,86.86 56.12,92.74 U8.4
+3V3  (via drill 0.25, 0.25 pad 0.25)  (1 unrouted)
  Top 0.15: 89.25,65.24 92.62,68.61 S2:P4:U3.8 92.75,68.74 93.25,68.74 94,69.49 94,70.36 93.75,70.61 89,70.61 | 89.25,65.24 88,63.99 88,63.61 S2:P2:U3.1 | 89.25,65.24 89.25,58.99 92.12,56.11 92.62,56.11 S2:P2:U3.8 | 78.88,64.99 82.5,68.61 S2:P3:U3.8 82.62,68.74 84.38,68.74 86.25,70.61 89,70.61 | 78.88,64.99 77.75,63.86 S2:P1:U3.1 | 89,70.61 89.25,70.86 89.25,75.36 88.38,76.24 88,76.24 S2:P4:U3.1 | MICROZED1.JX2_98 69.5,27.74 69.5,26.74 69,26.24 63,26.24 61.5,27.74 MICROZED1.JX2_78 61.62,27.74 62.38,27.74 MICROZED1.JX2_80 62.5,27.86 62.5,29.99 | 62.5,29.99 62.5,32.11 MICROZED1.JX2_79 | IC1701.47 16,44.99 15.62,44.99 IC1701.48 15.5,44.99 15.5,45.86 15,46.36 C1703.1 14.88,46.49 11,46.49 | IC1701.2 14.62,43.49 12,43.49 C1701.2 11.88,43.49 | 11,46.49 10.75,46.24 10.75,44.61 11.88,43.49 | 11.25,36.86 11.12,36.99 11.12,37.74 C1705.1 | 11.25,36.86 12.25,35.86 12.75,35.86 13.25,36.36 13.25,39.11 14.25,40.11 14.62,40.11 IC1701.9 | 11.25,36.86 11.25,39.11 R1702.2 11.25,39.24 11.25,39.99 R1701.2 11.25,40.11 11.25,40.99 R1704.1 11.25,41.11 11.25,41.74 R1703.1 11.38,41.86 11.88,42.36 11.88,43.49 | S1:P4:U3.1 87.88,50.99 82.88,55.99 82.62,55.99 S2:P1:U3.8 82.5,55.99 79.62,55.99 74.88,51.24 74.88,50.99 75.38,50.49 75.88,50.49 v76.25,50.86 77.62,50.86 S1:P3:U3.1 | S1:P3:U3.8 82.62,43.24 v84.12,43.24 84.88,43.24 86.5,41.61 91,41.61 92.62,43.24 S1:P4:U3.8 | S1:P1:U3.8 82.62,30.49 v84.38,30.49 86.12,30.49 86.75,29.86 92,29.86 92.62,30.49 S1:P2:U3.8 | C2705.1 14.38,67.99 15.12,67.24 15.12,66.49 IC2701.48 IC2701.47 | 10.75,61.11 10.75,60.79 | 10.75,60.79 10.75,60.11 C2704.1
  Top 0.15: 10.75,61.11 10.88,61.24 R2702.2 11,61.36 11,62.24 R2701.2 11,62.36 11,63.11 R2704.1 11,63.24 11,63.86 R2703.1 11,63.99 11.5,64.49 11.5,65.06 | 11.5,65.06 11.5,65.24 | 11.5,65.24 11.5,65.61 C2701.2 11.5,65.24 | 11.5,65.24 14.25,67.99 C2705.1 | 18,45.74 18,46.61 17.88,46.74 C1704.1 17.75,46.86 17.75,47.61 13.75,51.61 13.75,52.11 | 18,45.74 18,44.99 IC1701.43 | 13.75,52.11 13.75,52.49 OS1701.4 13.75,52.11 | 17.5,67.49 17.25,67.74 17.25,68.24 C2703.1 17.25,68.36 17.25,69.61 19.12,71.49 19.12,73.11 OS2701.4 19.12,73.24 18.25,74.11 15.75,74.11 14.38,72.74 14.38,68.11 C2705.1 | 17.5,67.49 17.62,67.36 17.62,66.49 IC2701.43 | R11.1 133.75,17.24 v133.75,18.11 133.75,18.86 133.5,19.11 133.5,19.36 134,19.86 134.75,19.86 136.25,18.36 R10.1 | 53.25,48.24 R1.2 | 55.38,48.49 U1.24 | 58.5,45.99 R4.2 | 59.25,45.99 R3.2 59.38,45.86 | v79.25,38.61 78.88,38.24 77.75,38.24 S1:P1:U3.1 | v86.62,39.49 87.88,38.24 S1:P2:U3.1 | v76.25,76.36 77.62,76.36 S2:P3:U3.1 | 72.5,8.46 72.62,8.99 U7.4 | 84.38,10.99 C5.1 | v17.25,67.24 17.5,67.49 | v17.75,45.74 18,45.74 | 11,46.49 11,50.86 10.25,51.61 10.25,53.36 10.38,53.49 12.38,53.49 13.75,52.11 | v60.25,29.99 62.5,29.99 | 78.88,64.99 79.38,64.49 v79.38,64.36 | 11.03,61.36 10.75,61.36 10.75,61.11 | 10.75,60.79 12.85,60.79 13.68,61.61 IC2701.9 | IC2701.2 arc-90 14.24,65.06 11.5,65.06 | R21.2 49.4,56.33 | 46.95,56.31 R20.1 | 46.94,54.61 U9.8
  Top 0.254: 54.25,48.24 55.12,48.24 55.38,48.49 | 54.25,48.24 53.25,48.24 | 59.25,45.99 58.5,45.99 | v59.38,45.11 59.38,45.86 | v54.25,48.61 54.25,48.24 | 11,61.36 11.03,61.36 | 49.4,56.33 49.4,56.86 | 49.4,56.89 46.95,56.89 46.95,56.31 | R20.1 46.94,54.61 C8.1 | 49.35,56.86 49.4,56.86 | 49.4,56.86 49.4,56.89 | 49.4,56.89 49.4,57.21
  Top 0.61: 84.38,10.99 79.1,10.94 74.7,6.79 73.7,6.76 72.5,8.46
  Bottom 0.15: S1:P4:C1.1 77.5,64.86 78.5,64.86 78.62,64.99 S1:P3:C3.1 78.75,64.99 v79.38,64.36 80,63.74 86.62,63.74 87.62,64.74 S1:P2:C1.1 87.75,64.86 88.75,64.86 88.88,64.99 S1:P4:C3.1 | S2:P3:C1.1 77.5,39.49 78.5,39.49 78.62,39.61 S2:P3:C3.1 78.75,39.61 79.5,38.86 | S2:P4:C3.1 88.88,39.61 88.75,39.49 87.75,39.49 S2:P4:C1.1 87.62,39.36 86.88,38.61 79.75,38.61 79.5,38.86 | S1:P2:C3.1 88.88,77.61 87.75,77.61 S1:P3:C1.1 87.62,77.49 84.38,77.49 83.62,76.74 79.62,76.74 78.75,77.61 S1:P1:C3.1 78.62,77.61 77.5,77.61 S1:P1:C1.1 77.38,77.49 v76.25,76.36 | S2:P1:C1.1 77.5,52.11 78.5,52.11 78.62,52.24 S2:P1:C3.1 78.75,52.24 79.62,51.36 | S2:P2:C3.1 88.88,52.24 88.75,52.11 87.75,52.11 S2:P2:C1.1 87.62,51.99 87,51.36 79.62,51.36 | v17.25,67.24 16.12,66.11 C2702.1 | v17.75,45.74 16.5,44.49 C1702.1 | v79.62,51.11 79.62,51.36 | v79.25,38.61 79.5,38.86
  other vias: 49.4,57.29
  pour +3V3 (isolate 0.254): 1.27,99.17 158.75,99.17 158.75,1.38 1.27,1.38
+5V  (via drill 0.25, 0.6)
  Top 0.25: S1:P2:R4.2 114.12,31.36 111.38,31.36 107.88,34.86 107.88,38.99 S1:P3:R4.2 108,38.99 108.75,39.74 108.75,52.86 | 115,52.86 120.62,52.86 U4.9 | 115,52.86 108.75,52.86 | 108.75,52.86 107.88,52.86 S2:P1:R4.2 107.75,52.86 93.88,52.86 v93.75,52.74 92.75,51.74 92.75,50.99 S1:P4:U3.14 | 115,52.86 115,45.99 114.62,45.61 114.5,45.61 114.25,45.36 S1:P4:R4.2 | MICROZED1.JX1_60 54.38,72.24 53.62,72.24 MICROZED1.JX1_58 53.62,72.36 53.62,76.49 MICROZED1.JX1_57 53.62,76.61 54.38,76.61 MICROZED1.JX1_59 54.5,76.61 54.5,81.61 | 34.12,81.61 34.12,79.86 R40.2 | 47.58,11.39 C4.1 | 57.7,11.39 C2.1 57.88,11.34 | S2:P3:R4.2 107.75,66.86 107.75,66.61 105.88,64.74 105.88,63.11 v107.75,61.24 109.62,59.36 114.12,59.36 S2:P2:R4.2 | MICROZED1.JX2_60 54.38,27.74 53.62,27.74 MICROZED1.JX2_58 53.62,27.86 v53.62,29.99 53.62,31.99 MICROZED1.JX2_57 53.62,32.11 54.38,32.11 MICROZED1.JX2_59 | U5.6 125.75,85.74 125.75,84.61 U5.5 125.88,84.61 v127.25,84.61 | U3.6 125.75,67.99 125.75,66.86 U3.5 125.88,66.86 v127.25,66.86 | U4.6 125.75,50.24 125.75,49.11 U4.5 125.88,49.11 v127.25,49.11 | U2.6 125.75,32.49 125.75,31.24 U2.5 125.88,31.24 v127.25,31.24 | R6.1 65.25,51.86 65.25,52.61 R8.1 65.25,52.74 65.25,54.36 R7.1 65.25,54.49 65.25,55.24 R9.1 65.38,55.24 v66.12,55.24 | v108.75,24.99 107.88,24.99 S1:P1:R4.2 | v115.12,73.24 114.25,73.24 S2:P4:R4.2 | v120.75,89.36 120.75,88.49 U5.9 | v80.38,39.61 81.75,38.24 82.5,38.24 S1:P1:U3.14 | v90.5,39.61 91.88,38.24 92.62,38.24 S1:P2:U3.14 | v83.62,52.74 82.62,51.74 82.62,50.99 S1:P3:U3.14 | S2:P1:U3.14 83,63.61 v83.88,64.49 | S2:P2:U3.14 91.5,63.61 v90.75,64.36
  Top 0.25: v84.25,76.36 82.62,76.36 S2:P3:U3.14 | v90.5,77.74 91.88,76.36 92.62,76.36 S2:P4:U3.14 | v35.25,29.49 35.25,27.86 MICROZED1.JX2_12 | 69.12,9.11 U7.2 | v89.38,87.99 89.38,87.91
  Top 0.61: 57.7,11.39 47.58,11.39 | 57.88,11.34 68.08,11.36 69.2,10.24 69.12,9.11
  Bottom 0.25: S2:P1:R2.2 111.88,12.11 v113.12,12.11 114.25,12.11 S2:P2:R2.2 114.38,12.11 116.75,12.11 S2:P3:R2.2 116.88,12.11 S2:P4:R2.2 | S1:P1:R2.2 101.62,12.11 104.12,12.11 S1:P2:R2.2 104.25,12.11 106.62,12.11 S1:P3:R2.2 106.75,12.11 v108,12.11 109.12,12.11 S1:P4:R2.2 | R2.2 88.12,87.99 v89.38,87.99 90.5,87.99 R5.2 | S1:P2:C2.1 92.62,77.61 91.5,77.61 S1:P2:C4.1 91.38,77.74 v90.5,77.74 | S1:P1:C2.1 82.5,77.61 81.38,77.61 S1:P1:C4.1 81.25,77.74 v80.38,77.74 | S1:P4:C2.1 92.62,64.86 91.62,64.86 91.5,64.99 S1:P4:C4.1 91.38,64.99 v90.75,64.36 | S1:P3:C4.1 81.38,64.99 81.5,64.86 82.5,64.86 S1:P3:C2.1 82.62,64.74 82.88,64.49 v83.88,64.49 | S2:P2:C4.1 91.5,52.24 91.62,52.11 92.62,52.11 S2:P2:C2.1 92.75,52.11 93.38,52.74 v93.75,52.74 | S2:P1:C4.1 81.38,52.24 81.5,52.11 82.5,52.11 S2:P1:C2.1 82.62,52.11 83.25,52.74 v83.62,52.74 | S2:P4:C2.1 92.62,39.49 91.62,39.49 91.5,39.61 S2:P4:C4.1 91.38,39.61 v90.5,39.61 | S2:P3:C2.1 82.5,39.49 81.5,39.49 81.38,39.61 S2:P3:C4.1 81.25,39.61 v80.38,39.61
  other vias: 27.07,86.36 25.27,84.74 27.1,84.54 23.6,83.06 25.25,83.01 27.12,82.89 78.97,85.81 81.05,85.79 80.95,83.64 83.1,83.74 83.1,85.81 85.08,85.79 85.22,83.74 87.22,85.81 78.8,83.76
  pour +5V (isolate 0.61): 1.27,99.17 158.75,99.17 158.75,1.38 1.27,1.38 1.27,16.62
  pour Top (isolate 0.61, rank 2): 17.4,87.91 100,87.91 100,81.61 17.4,81.61
+12V  (via drill 0.25)
  Top 0.35: 107.44,81.05 110.5,84.11 S2:P4:U1.4 | 107.44,81.05 104.25,77.86 S2:P3:U1.4 | v104.12,34.61 104.12,35.86 S1:P1:U1.4 | v110.5,43.61 110.5,42.36 S1:P2:U1.4 | v104.12,48.61 104.12,49.86 S1:P3:U1.4 | v110.5,54.99 110.5,56.24 S1:P4:U1.4 | v103.25,63.86 104.12,63.86 S2:P1:U1.4 | v110.5,71.49 110.5,70.24 S2:P2:U1.4 | 20.88,10.99 C1.1 | 6.38,10.99 X1.2 | 107.44,81.05 101.5,86.99 v101.5,87.11
  Top 1.016: 6.38,10.99 20.88,10.99
  GND+12V 0.35: v101.5,87.11 101.8,87.01
  Bottom 0.35: v101.5,87.11 98.5,90.11 90.25,90.11 90,90.36 89.5,90.36 89.38,90.24 86.75,90.24 85.62,91.36 SV1.3
  pour GND+12V (isolate 0.254): 102.79,87.08 104.71,87.06 104.89,13.4 105.56,13.42 108.84,13.42 108.84,87.03 111.76,87.01 111.26,15.13 111.48,15.2 111.43,4.38 105.49,4.31 2.72,4.08 2.59,13.42 102.11,13.42 101.8,87.01
C1_N  (via drill 0.25)
  Top 0.15: v35.98,70.44 35.95,70.64 35.95,72.14 36,72.19 MICROZED1.JX1_14
  Difflines 0.15: J1.P1-7 136.95,28.05 133.93,28.09 133.93,23.66 133.75,23.66 36.92,23.79 36.98,67.59 35.75,67.59 35.75,70.64 v35.98,70.44
C1_P  (via drill 0.25)
  Top 0.15: v35.22,70.44 35.3,70.61 35.3,72.11 35.25,72.11 35.25,72.19 MICROZED1.JX1_12
  Difflines 0.15: J1.P1-8 134.25,26.77 134.25,23.36 36.62,23.49 36.67,67.29 35.45,67.29 35.45,70.64 v35.22,70.44
C2_N  (via drill 0.25)
  Top 0.15: v38.43,70.44 38.4,70.61 38.38,72.14 38.4,72.19 MICROZED1.JX1_20
  Difflines 0.15: J1.P2-7 146.05,38.01 89.83,38.01 89.33,38.04 38.2,38.24 38.2,70.54 v38.43,70.44
C2_P  (via drill 0.25)
  Top 0.15: v37.67,70.44 37.73,70.59 37.73,72.11 37.65,72.11 37.65,72.19 MICROZED1.JX1_18
  Difflines 0.15: J1.P2-8 145.75,35.65 145.75,37.71 90.3,37.64 90.12,37.66 89.9,37.64 89.58,37.64 88.15,37.69 37.88,37.76 37.9,70.54 v37.67,70.44
C3_N  (via drill 0.25)
  Top 0.15: v40.8,70.43 40.77,72.16 40.8,72.19 MICROZED1.JX1_26
  Difflines 0.15: 136.85,42.23 136.85,42.04 | 136.85,42.04 136.85,40.69 40.58,40.69 40.58,70.56 40.77,70.56 v40.8,70.43 | 136.85,42.04 136.88,42.04 J1.P3-7
C3_P  (via drill 0.25)
  Top 0.15: v40.04,70.44 40.05,72.14 40.05,72.19 MICROZED1.JX1_24
  Difflines 0.15: J1.P3-8 137.15,40.8 137.15,40.39 40.27,40.39 40.27,70.59 v40.04,70.44 40.02,70.56
C4_N  (via drill 0.25)
  Top 0.15: v43.13,70.41 v43.12,70.41 43.15,72.09 43.17,72.2 | 43.17,72.2 43.17,72.21 | MICROZED1.JX1_32 43.2,72.19 43.17,72.2
  Difflines 0.15: J1.P4-7 146.05,52.01 42.9,52.01 42.9,70.44 v43.13,70.41
C4_P  (via drill 0.25)
  Top 0.15: v42.37,70.41 42.4,70.46 42.4,71.81 42.42,72.11 | 42.42,72.11 | MICROZED1.JX1_30 42.38,72.19 42.38,72.11 42.42,72.11
  Difflines 0.15: J1.P4-8 145.75,49.62 145.75,51.71 42.6,51.71 42.6,70.44 v42.37,70.41
C5_N  (via drill 0.25)
  Top 0.15: v45.6,70.39 45.52,70.61 45.52,72.19 | 45.52,72.19 45.52,72.21 | 45.52,72.19 MICROZED1.JX1_38
  Difflines 0.15: J1.P5-7 135.78,55.99 135.78,53.99 45.38,53.99 45.38,70.49 v45.6,70.39
C5_P  (via drill 0.25)
  Top 0.15: v44.85,70.39 44.9,70.54 44.88,72.16 44.85,72.19 MICROZED1.JX1_36
  Difflines 0.15: J1.P5-8 136.07,54.72 136.07,53.69 45.08,53.69 45.08,70.49 v44.85,70.39
C6_N  (via drill 0.25)
  Top 0.15: v47.98,70.39 47.98,70.46 47.98,72.18 | 47.98,72.18 47.98,72.96 47.92,71.36 | MICROZED1.JX1_44 48,72.19 47.98,72.18
  Difflines 0.15: J1.P6-7 146.05,65.51 47.75,65.51 47.75,70.46 v47.98,70.39
C6_P  (via drill 0.25)
  Top 0.15: v47.22,70.39 47.23,70.44 47.22,72.19 | 47.22,72.19 47.22,72.69 47.2,72.24 | MICROZED1.JX1_42 47.17,72.19 47.22,72.19
  Difflines 0.15: J1.P6-8 145.75,63.59 145.75,65.21 47.45,65.21 47.45,70.46 v47.22,70.39
C7_N  (via drill 0.25)
  Top 0.15: v50.38,70.36 50.4,70.39 50.38,72.01 50.42,72.18 | 50.42,72.18 50.42,72.19 | MICROZED1.JX1_50 50.4,72.19 50.42,72.18
  Difflines 0.15: J1.P7-7 137.07,70.01 137.07,68.11 50.17,68.11 50.17,70.36 v50.38,70.36
C7_P  (via drill 0.25)
  Top 0.15: v49.65,70.36 49.65,70.69 49.65,72.19 | 49.65,72.19 49.65,72.29 49.58,72.21 | MICROZED1.JX1_48 49.58,72.19 49.65,72.19
  Difflines 0.15: J1.P7-8 137.38,68.74 137.38,67.84 49.88,67.84 49.88,70.36 v49.65,70.36
C8_N  (via drill 0.25)
  Top 0.15: v52.78,70.44 52.8,70.54 52.8,72.19 | 52.8,72.19 MICROZED1.JX1_56 | MICROZED1.JX1_56 52.8,72.19
  Difflines 0.15: J1.P8-7 144.97,76.21 144.97,79.44 130.75,79.41 130.75,69.36 52.58,69.36 52.58,70.51 v52.78,70.44
C8_P  (via drill 0.25)
  Top 0.15: v52.02,70.44 52.02,70.56 52.02,72.19 | 52.02,72.19 52.02,72.24 | MICROZED1.JX1_54 51.98,72.19 52.02,72.19
  Difflines 0.15: J1.P8-8 144.68,77.61 144.68,79.09 131.1,79.04 131.13,69.04 52.27,69.06 52.27,70.51 v52.02,70.44
CLK1  (via drill 0.25)
  Top 0.15: v84.88,33.11 82.62,33.11 S1:P1:U3.10
  Bottom 0.15: v84.88,33.11 88.12,29.86 102.75,29.86 104.62,27.99 135.5,27.99 136.75,29.24 139.38,29.24 J1.P1-6
CLK2
  Top 0.15: J1.P2-6 146.12,33.11 147.12,32.11 147.12,26.49 146.38,25.74 144,25.74 139.5,21.24 107.88,21.24 96,33.11 92.75,33.11 S1:P2:U3.10
CLK3  (via drill 0.25)
  Top 0.15: v85.5,43.36 83.12,45.74 82.62,45.74 S1:P3:U3.10
  Bottom 0.15: v85.5,43.36 85.75,43.11 95.62,43.11 96.88,41.86 107.62,41.86 107.88,42.11 119.62,42.11 119.88,41.86 135.38,41.86 136.75,43.24 139.38,43.24 J1.P3-6
CLK4  (via drill 0.25)
  Top 0.15: v94.25,45.49 94,45.74 92.75,45.74 S1:P4:U3.10
  Bottom 0.15: v94.25,45.49 95.88,43.86 109.75,43.86 111.12,45.24 136.12,45.24 136.88,45.99 138,45.99 139,46.99 143.5,46.99 J1.P4-6
CLK5
  Top 0.15: S2:P1:U3.10 82.62,58.49 83.38,58.49 86.62,55.24 103,55.24 103.88,54.36 104.88,54.36 105.75,55.24 105.75,56.11 106.88,57.24 109.88,57.24 110,57.36 136.25,57.36 136.38,57.24 139.38,57.24 J1.P5-6
CLK6
  Top 0.15: S2:P2:U3.10 92.75,58.49 93.75,58.49 96.5,55.74 98.75,55.74 103.38,60.36 107.88,60.36 110.5,57.74 136.38,57.74 136.5,57.61 138.5,57.61 139.62,58.74 141.25,58.74 143.5,60.99 J1.P6-6
CLK7  (via drill 0.25)
  Top 0.15: v85,70.11 84,71.11 82.62,71.11 S2:P3:U3.10
  Bottom 0.15: v85,70.11 85.75,69.36 134.88,69.36 136.75,71.24 139.38,71.24 J1.P7-6
CLK8  (via drill 0.25)
  Top 0.15: v94.25,71.24 92.75,71.24 S2:P4:U3.10
  Bottom 0.15: v94.25,71.24 94.5,71.49 109.5,71.49 112,73.99 138,73.99 139,74.99 143.5,74.99 J1.P8-6
GND  (via drill 0.25)
  Top 0.15: S2:P4:LED3.2 120.67,73.79 S2:P3:LED3.2 120.67,73.73 v120.67,72.04 | S2:P2:LED3.2 123.97,59.11 v126.15,59.11 | S2:P1:LED3.2 123.94,54.79 v126.1,54.79 | S1:P3:LED3.2 124.17,37.69 S1:P4:LED3.2 125.05,39.01 v125.05,38.79 | S1:P2:LED3.2 124.92,21.64 135.57,21.64 136.66,22.72 J1.GND@5 | S1:P1:LED3.2 126,19.99
  Top 0.25: 51.25,74.36 51.25,76.49 MICROZED1.JX1_51 | 51.25,74.36 51.25,72.24 MICROZED1.JX1_52 | 46.5,74.36 46.5,76.49 MICROZED1.JX1_39 | 46.5,74.36 46.5,72.24 MICROZED1.JX1_40 | 48.88,74.36 48.88,76.49 MICROZED1.JX1_45 | 48.88,74.36 48.88,72.24 MICROZED1.JX1_46 | 48.88,74.36 46.5,74.36 | 48.88,74.36 51.25,74.36 | MICROZED1.JX1_33 44,74.36 | 44,74.36 MICROZED1.JX1_34 | 41.62,74.36 41.62,76.49 MICROZED1.JX1_27 | 41.62,74.36 41.62,72.24 MICROZED1.JX1_28 | 36.88,74.99 36.88,76.49 MICROZED1.JX1_15 | 36.88,74.99 36.88,74.36 | 36.88,74.36 36.88,72.24 MICROZED1.JX1_16 | 39.25,74.36 39.25,76.49 MICROZED1.JX1_21 | 39.25,74.36 39.25,72.24 MICROZED1.JX1_22 | 39.25,74.36 36.88,74.36 | 39.25,74.36 41.62,74.36 | 41.62,74.36 44,74.36 | 44,74.36 46.5,74.36 | 12,58.74 12,55.74 11.25,54.99 OS1701.2 | 12,58.74 12,59.11 | 12,59.11 12,59.99 C2704.2 | 12,58.74 19.25,51.49 C1704.2 | R42.1 32.75,79.74 31.62,79.74 C9.1 31.5,79.61 30.5,79.61 | 30.5,79.61 20.62,79.61 16.75,75.74 OS2701.2 16.62,75.74 15.81,74.93 | 15.81,74.93 11.62,70.74 11.62,67.74 C2701.1 11.5,67.74 9.88,66.11 9.88,59.36 10.12,59.11 12,59.11 | 36.88,74.99 30.75,74.99 30.5,75.24 30.5,79.61 | 51.25,29.99 51.25,32.11 MICROZED1.JX2_51 | 51.25,29.99 51.25,27.86 MICROZED1.JX2_52 51.25,27.74 51.25,22.61 51.25,22.33 | 46.5,29.99 46.5,32.11 MICROZED1.JX2_39 | 46.5,29.99 46.5,27.86 MICROZED1.JX2_40 | 48.88,29.99 48.88,32.11 MICROZED1.JX2_45 | 48.88,29.99 48.88,27.86 MICROZED1.JX2_46 | 48.88,29.99 46.5,29.99 | 48.88,29.99 51.25,29.99 | MICROZED1.JX2_33 44,29.99 | 44,29.99 MICROZED1.JX2_34 | 41.62,29.99 41.62,32.11 MICROZED1.JX2_27 | 41.62,29.99 41.62,27.86 MICROZED1.JX2_28 | 36.88,29.99 36.88,32.11 MICROZED1.JX2_15
  Top 0.25: 36.88,29.99 36.88,27.86 MICROZED1.JX2_16 | 39.25,29.99 39.25,32.11 MICROZED1.JX2_21 | 39.25,29.99 39.25,27.86 MICROZED1.JX2_22 | 39.25,29.99 36.88,29.99 | 39.25,29.99 41.62,29.99 | 41.62,29.99 44,29.99 | 44,29.99 46.5,29.99 | U3.12 120.75,66.86 120.75,67.99 U3.11 120.75,68.11 120.75,69.24 U3.10 120.75,69.36 120.75,70.49 U3.9 120.62,70.61 114.88,70.61 113.25,72.24 v108.12,72.24 106.75,72.24 S2:P3:U1.2 | v64.88,74.36 64.88,76.49 MICROZED1.JX1_85 | v64.88,74.36 64.88,72.24 MICROZED1.JX1_86 64.75,72.11 64.75,70.99 64.38,70.61 59.62,70.61 59.25,70.99 59.25,72.11 MICROZED1.JX1_72 59.25,72.24 59.25,74.36 | 68.88,74.36 68.88,76.49 MICROZED1.JX1_95 | 68.88,74.36 68.88,72.24 MICROZED1.JX1_96 | 68.88,74.36 v64.88,74.36 | 56.88,74.36 56.88,76.49 MICROZED1.JX1_65 | 56.88,74.36 56.88,72.24 MICROZED1.JX1_66 | 59.25,74.99 59.25,76.49 MICROZED1.JX1_71 | 59.25,74.99 59.25,74.36 | 59.25,74.99 61.25,74.99 61.5,75.24 61.5,76.49 MICROZED1.JX1_77 | 59.25,74.36 56.88,74.36 | C1701.1 12,45.36 v13.38,45.36 14,45.36 15.3,44.07 16.24,43.13 16.61,42.75 18,41.36 18.25,41.36 IC1701.49 | 120,31.86 120.62,32.49 U2.11 120.75,32.61 120.75,33.74 U2.10 120.75,33.86 120.75,34.99 U2.9 120.62,35.11 114.88,35.11 113.25,36.74 S1:P2:U1.2 113.12,36.74 113.12,39.49 v113.25,39.61 113.12,39.61 112,40.74 112,44.49 | 120,31.86 119.25,31.11 119.25,28.24 120,27.49 120.62,27.49 U2.15 | 120,31.86 120.62,31.24 U2.12 | 64.88,30.11 64.88,32.11 MICROZED1.JX2_85 64.75,32.24 64.75,33.49 64.5,33.74 62,33.74 v62,33.86 61.62,33.49 61.62,32.24 MICROZED1.JX2_77 | 64.88,30.11 64.88,27.86 MICROZED1.JX2_86 | 67.25,30.11 67.25,32.11 MICROZED1.JX2_91
  Top 0.25: 67.25,30.11 67.25,27.86 MICROZED1.JX2_92 | 67.25,30.11 64.88,30.11 | 119.31,45.93 119.25,45.99 119.25,48.86 120.06,49.68 | 119.31,45.93 120,45.24 120.62,45.24 U4.15 | 120.06,49.68 120.62,50.24 U4.11 120.75,50.36 120.75,51.49 U4.10 | 120.06,49.68 120.62,49.11 U4.12 | 59.25,29.99 59.25,32.11 MICROZED1.JX2_71 | 59.25,29.99 59.25,27.86 MICROZED1.JX2_72 | S3.4 135,6.36 132.62,6.36 S3.3 132.5,6.36 123.25,6.36 v120.88,8.74 | U5.10 120.75,86.99 120.75,85.86 U5.11 120.75,85.74 120.75,84.61 U5.12 120.62,84.49 120,84.49 116.38,80.86 | U1.2 61.38,49.24 61.38,48.61 U1.1 61.25,48.61 v60,48.61 | v12.5,36.61 12.5,37.74 C1705.2 | v16.38,47.49 16.38,46.49 C1703.2 | v15.75,69.24 15.75,68.11 C2705.2 | v18.62,69.49 18.62,68.36 C2703.2 | v107,32.86 106.75,32.61 106.75,30.36 S1:P1:U1.2 | v107,47.49 106.75,47.24 106.75,44.36 S1:P3:U1.2 | v106.75,59.61 106.75,58.36 S2:P1:U1.2 | 112,44.49 112,48.74 113,49.74 113,50.61 S1:P4:U1.2 | v112.62,66.49 113,66.11 113,64.74 S2:P2:U1.2 113.12,64.61 116.62,64.61 118.25,62.99 120.62,62.99 U3.15 | 113.12,80.86 113.12,81.61 v113.25,81.74 | 113.12,80.86 113.12,78.61 S2:P4:U1.2 | v61.38,56.61 61.38,55.86 U1.12 | J1.P1-4 136.5,31.86 133.38,28.74 125.75,28.74 U2.3 | v127.25,46.36 125.75,46.36 U4.3 | U3.3 125.75,64.24 134.62,64.24 136.62,62.24 137.38,62.24 139.38,60.24 139.38,59.86 J1.P5-4 | 113.12,80.86 116.38,80.86 | 116.38,80.86 120.62,80.86 U5.15 | v127.25,82.11 125.75,82.11 U5.3 | S1:P1:U3.7 77.75,30.49 77.75,22.49 77.75,22.28 | v89.62,30.61 88,30.61 S1:P2:U3.7 | v77.75,42.36 77.75,43.24 S1:P3:U3.7 | v88,42.36 88,43.24 S1:P4:U3.7 | v76.12,55.99 77.62,55.99 S2:P1:U3.7
  Top 0.25: v89.62,55.99 88,55.99 S2:P2:U3.7 | v75.88,66.86 77.62,68.61 S2:P3:U3.7 | v86.12,66.86 87.88,68.61 S2:P4:U3.7 | 56.94,29.43 v57.5,29.99 59.25,29.99 | 56.94,29.43 56.88,29.36 56.88,27.86 MICROZED1.JX2_66 | MICROZED1.JX2_65 56.88,32.11 56.88,29.49 56.94,29.43 | 112,44.49 114.75,44.49 116.12,45.86 119.25,45.86 119.31,45.93 | 17.62,62.86 IC2701.49 | 15.01,65.48 14.25,66.24 v13.62,66.24 | 15.81,74.93 8.62,82.11 X2.S@2 | 126,19.99 126.03,20.09 v126.1,20.06
  Top 0.254: 16.29,64.2 15.01,65.48 14.9,65.58 IC2701.1 | 16.45,64.04 17.62,62.86 | v57.12,52.64 57.12,51.31 56.48,50.66 55.7,50.66 55.59,50.56 U1.21 52.27,50.54 52.27,49.19 U9.4 U9.3 U9.2 | C1703.2 16.33,46.16 16.4,46.09 16.4,45.76 16.57,45.59 16.57,44.94 IC1701.46 16.54,43.43 16.24,43.13 | 16.61,42.75 15.9,42.04 15.88,42.05 IC1701.5 IC1701.6 15.23,41.55 15.28,41.51 15.28,39.55 | IC1701.10 15.28,39.55 | 15.28,39.55 16.04,39.55 16.1,39.49 | IC2701.46 16.14,66.92 15.75,67.31 C2705.2 | C2703.2 18.58,68.77 18.6,68.79 18.6,69.46 v18.62,69.49 | 14.31,63.59 IC2701.5 IC2701.6 14.75,63.11 14.88,62.99 v16.12,62.99 16.45,63.11 | 16.26,64.2 16.29,64.2 | IC2701.10 16.38,61.11 16.45,61.19 16.45,63.11 | 16.29,64.2 16.45,64.04 | 16.45,64.04 16.45,63.11 | IC1701.1 14.72,44.09 14.75,44.07 15.3,44.07 | U9.7 U9.2 | U9.2 U9.1 45.38,49.19 C8.2
  +5V 0.254: v57.12,52.64 57.12,51.49 v60,48.61
  GND+12V 0.25: v112,3.86 111.94,3.6 | v108.12,72.24 107.92,72.24
  Bottom 0.25: S2:P1:U4.2 106,61.49 106,65.99 92.62,65.99 S1:P4:C2.2 92.62,66.11 91.5,66.11 S1:P4:C4.2 91.38,65.99 89,65.99 S1:P4:C3.2 88.88,66.11 87.75,66.11 S1:P2:C1.2 87,66.86 v86.12,66.86 | S2:P3:U5.2 117.38,8.74 117.38,9.74 115.62,9.74 114.88,8.99 S2:P2:U5.2 115,8.74 114,9.74 112.5,9.74 112.5,8.74 S2:P1:U5.2 112.5,8.61 112.5,4.99 112,4.99 | 103.94,9.68 104.88,8.74 S1:P2:U5.2 | 103.94,9.68 103.88,9.74 102.38,9.74 102.38,8.74 S1:P1:U5.2 | 107.25,9.74 107.25,8.74 S1:P3:U5.2 | 107.25,9.74 104,9.74 103.94,9.68 | 107.25,9.74 109,9.74 109.25,9.49 109.88,9.49 109.88,8.74 S1:P4:U5.2 110,8.61 110,6.49 111.5,4.99 112,4.99 | S1:P1:C1.2 77.5,78.86 78.5,78.86 78.62,78.74 S1:P1:C3.2 78.75,78.74 v80,78.74 81.25,78.74 S1:P1:C4.2 81.38,78.74 81.5,78.86 82.5,78.86 S1:P1:C2.2 82.62,78.99 87.62,78.99 S1:P3:C1.2 87.75,78.86 88.75,78.86 88.88,78.74 S1:P2:C3.2 89,78.74 91.38,78.74 S1:P2:C4.2 91.5,78.74 91.62,78.86 92.62,78.86 S1:P2:C2.2 | S1:P3:C2.2 82.5,66.11 81.38,66.11 S1:P3:C4.2 81.25,65.99 78.75,65.99 S1:P3:C3.2 78.62,66.11 77.5,66.11 S1:P4:C1.2 77.38,66.24 76.75,66.86 v75.88,66.86 | S2:P2:C2.2 92.62,53.49 91.62,53.49 91.5,53.36 S2:P2:C4.2 91.38,53.36 89,53.36 S2:P2:C3.2 88.88,53.36 88.75,53.49 87.75,53.49 S2:P2:C1.2 87.62,53.61 82.62,53.61 S2:P1:C2.2 82.5,53.49 81.5,53.49 81.38,53.36 S2:P1:C4.2 81.25,53.36 78.75,53.36 S2:P1:C3.2 78.62,53.36 78.5,53.49 77.5,53.49 S2:P1:C1.2 77.38,53.61 76.12,54.86 v76.12,55.99 | S2:P4:C2.2 92.62,40.74 91.62,40.74 91.5,40.61 S2:P4:C4.2 91.38,40.61 89,40.61 S2:P4:C3.2 88.88,40.61 88.75,40.74 87.75,40.74 S2:P4:C1.2 87.75,40.86 87.75,42.36 v88,42.36
  Bottom 0.25: S2:P3:C2.2 82.5,40.74 81.5,40.74 81.38,40.61 S2:P3:C4.2 81.25,40.61 S2:P3:C3.2 78.62,40.61 78.5,40.74 77.5,40.74 S2:P3:C1.2 77.5,40.86 77.5,42.36 v77.75,42.36 | v57.5,29.99 58.25,29.99 | R36.1 55.38,95.86 55.38,94.61 54.5,93.74 54.5,92.86 U8.3 | v12.5,36.61 12.5,42.61 13.62,43.74 14.38,43.74 15,44.36 C1702.2 | v13.62,66.24 14.5,66.24 14.62,66.11 C2702.2 | v120.88,8.74 120.12,8.74 S2:P4:U5.2 | v107,32.86 106.62,32.86 106.12,33.36 S1:P1:U4.2 | v107,47.49 106.12,47.49 S1:P3:U4.2 | v113.25,39.61 112.62,39.61 112.5,39.74 S1:P2:U4.2 | v112.5,54.99 112.5,53.86 S1:P4:U4.2 | v107,75.36 106.12,75.36 S2:P3:U4.2 | v112.62,66.49 112.5,66.49 112.5,67.61 S2:P2:U4.2 | v113.25,81.74 112.5,81.74 S2:P4:U4.2 | v112,3.86 112,4.99
  Bottom 0.254: 57.12,52.69 v57.12,52.64
  other vias: 17.62,43.36 19.25,43.36 16.62,42.24 17.62,42.24 19.25,42.24 19.25,41.36 17.62,41.36 16.62,41.36 16.62,40.49 17.62,40.49 19.25,40.49 19.25,39.36 17.62,39.36 16.62,39.36
  pour GND+12V (isolate 0.305, rank 2): 0.5,0.61 0.5,99.61 159.5,99.61 159.5,97.11 159.5,0.61
  pour Top (isolate 0.61, rank 2): 2.64,22.42 88.49,22.26 88.44,13.98 2.79,14.08
  pour Top (isolate 0.61, rank 2): 17.5,99.11 17.4,88.61 99.8,88.81 99.7,97.91 99.7,99.21 99.4,99.21
  pour Difflines (isolate 0.254): 1.12,99.39 158.85,99.39 159.1,99.14 159.35,0.86 1,0.99 1,1.11
I2C_SCL  (via drill 0.25)
  Top 0.15: 58.25,47.11 56.38,47.11 51.12,41.86 41.75,41.86 33.62,33.74 33.62,32.24 MICROZED1.JX2_7 | 58.25,47.11 58.38,47.11 R4.1 58.25,47.11 | v59.12,52.61 56.5,49.99 55.5,49.99 U1.22 | v64,50.99 64,49.74 60.75,46.49 58.88,46.49 58.25,47.11
  Bottom 0.15: v59.12,52.61 60.12,51.61 63.38,51.61 v64,50.99
I2C_SDA
  Top 0.15: R1.1 53.25,49.36 55.38,49.36 U1.23 55.5,49.24 56.12,49.24 56.5,48.86 56.5,48.36 51.75,43.61 42.75,43.61 32.62,33.49 30.75,33.49 30.62,33.36 30.62,30.99 32.5,29.11 33.12,29.11 33.5,28.74 33.5,27.86 MICROZED1.JX2_8
LED1  (via drill 0.25)
  Top 0.15: v126.88,25.49 131.88,25.49 136.88,30.49 J1.P1-5
  Bottom 0.15: v126.88,25.49 124.5,25.49 124.5,25.71 R12.1
LED2
  Bottom 0.15: J1.P2-5 146.12,31.74 147.12,31.74 147.12,28.86 146.5,28.24 146.12,28.24 143.75,25.86 139,25.86 138.75,26.11 121.25,26.11 120.75,25.61 R13.1
LED3
  Bottom 0.15: J1.P3-5 125.75,44.61 124.5,43.36 R14.1
LED4
  Bottom 0.15: J1.P4-5 146,45.74 143.12,45.74 142.12,44.74 139.5,44.74 138.38,43.61 136.62,43.61 135.62,42.61 121.38,42.61 120.75,43.24 120.78,43.24 R15.1
LED5
  Bottom 0.15: J1.P5-5 137,58.61 140.62,58.61 140.62,62.49 139.75,63.36 139.12,63.36 138.38,62.61 136.88,62.61 135.62,61.36 124.75,61.36 124.5,61.11 124.4,61.11 R16.1
LED6
  Bottom 0.15: J1.P6-5 146,59.86 143.88,61.99 143.75,61.99 141.12,64.61 136.5,64.61 133.62,61.74 121.38,61.74 120.75,61.11 120.75,61.13 R17.1
LED7  (via drill 0.25)
  Top 0.15: v127.25,75.99 133.5,75.99 136.88,72.61 J1.P7-5
  Bottom 0.15: v127.25,75.99 124.5,78.74 124.5,78.81 R18.1
LED8
  Bottom 0.15: J1.P8-5 146,73.86 143.88,75.99 143.75,75.99 140.25,79.49 121.38,79.49 120.75,78.86 R19.1
N$1  (via drill 0.25)
  Top 0.15: 13.12,64.61 12.75,64.61 12.12,63.99 R2703.2 | 13.12,64.61 IC2701.3 | v60.12,53.11 61.25,53.11 U1.8 | 13.12,64.61 v13.12,63.61
  Bottom 0.15: v60.12,53.11 57.38,55.86 15.75,55.86 12.62,58.99 12.62,63.61 v13.12,63.61
N$2  (via drill 0.25)
  Top 0.15: v58.75,55.74 60.62,53.86 61.25,53.86 U1.9 | R2704.2 12.12,63.11 12.88,63.11 v13.25,62.74 13.45,62.74 13.72,63.01 13.72,64.11 IC2701.4
  Bottom 0.15: v13.25,62.74 16.5,59.49 16.5,56.24 58.25,56.24 v58.75,55.74
N$3
  Top 0.15: R3.1 59.25,47.11 59.25,48.86 60.25,49.86 61.25,49.86 U1.3
N$4  (via drill 0.25)
  Top 0.15: v124.12,63.61 124.12,64.61 125,65.49 125.62,65.49 U3.4
  Bottom 0.15: v124.12,63.61 124.38,63.61 124.38,62.32 R16.2
N$8  (via drill 0.25)
  Top 0.15: v119.25,63.74 120.12,63.74 120.62,64.24 U3.14
  Bottom 0.15: v119.25,63.74 120.62,62.36 120.62,62.3 R17.2
N$9  (via drill 0.25)
  Top 0.15: v122.12,81.49 121.25,81.49 120.75,81.99 U5.14
  Bottom 0.15: 122,81.49 v122.12,81.49 122.1,81.46 122.1,80.86 121.36,80.12 R19.2
N$10  (via drill 0.25)
  Top 0.15: v124.25,81.24 124.25,82.49 125,83.24 125.62,83.24 U5.4
  Bottom 0.15: v124.25,81.24 124.38,81.24 124.38,80.24 124.4,80.21 R18.2
N$11  (via drill 0.25)
  Top 0.15: v123.5,27.36 123.5,28.36 125,29.86 125.62,29.86 U2.4
  Bottom 0.15: 124.28,26.96 123.88,27.36 v123.5,27.36 | 124.28,26.96 124.38,26.86 | R12.2 124.28,26.87 124.28,26.96
N$12  (via drill 0.25)
  Top 0.15: v122.38,26.99 122.38,27.24 122.12,27.49 122.12,27.86 121.38,28.61 120.75,28.61 U2.14
  Bottom 0.15: v122.38,26.99 120.88,26.99 120.75,26.86 120.65,26.86 R13.2
N$13  (via drill 0.25)
  Top 0.15: v122.12,44.49 122.12,45.61 121.38,46.36 120.75,46.36 U4.14
  Bottom 0.15: v122.12,44.49 120.8,44.49 | 120.8,44.49 120.75,44.49 | R15.2 120.8,44.47 120.8,44.49
N$14  (via drill 0.25)
  Top 0.15: v123.5,44.61 123.5,46.24 125,47.74 U4.4
  Bottom 0.15: v123.5,44.61 124.38,44.61 124.38,44.47 R14.2
N$15  (via drill 0.25)
  other vias: 17,62.99
N$16  (via drill 0.25)
  other vias: 17.88,62.99
N$17  (via drill 0.25)
  other vias: 18.75,62.99
N$18  (via drill 0.25)
  other vias: 19.62,62.99
N$19  (via drill 0.25)
  other vias: 16.12,63.99
N$20  (via drill 0.25)
  other vias: 17,63.99
N$21  (via drill 0.25)
  other vias: 17.88,63.99
N$22  (via drill 0.25)
  other vias: 18.75,63.99
N$23
  Top 0.15: R34.2 37.5,13.11 37.5,9.11 U6.5
N$24
  Bottom 0.15: R36.2 56.75,95.86 56.75,94.61 57.75,93.61 57.75,92.86 U8.5
N$25  (via drill 0.25)
  other vias: 19.62,63.99
N$26
  Top 0.15: R35.2 74.38,13.11 74.38,9.11 U7.5
N$27  (via drill 0.25)
  other vias: 19.62,64.86
N$28  (via drill 0.25)
  other vias: 18.75,64.86
N$29  (via drill 0.25)
  other vias: 17.88,64.86
N$30  (via drill 0.25)
  other vias: 17,64.86
N$31  (via drill 0.25)
  other vias: 16.12,64.86
N$32  (via drill 0.25)
  other vias: 16.12,61.99
N$33  (via drill 0.25)
  other vias: 17,61.99
N$34  (via drill 0.25)
  other vias: 17.88,61.99
N$35  (via drill 0.25)
  other vias: 18.75,61.99